# EasyEDA Pro project ProPrj_ESP_AI_MINI_V1.0_2025-04-29.epro

# Schematic Sche_MINI_V1.0

## Sheets
1 Block: Create Date: 2025-03-31; Company: 嘉立创EDA; Page Size: A4; Version: V1.0
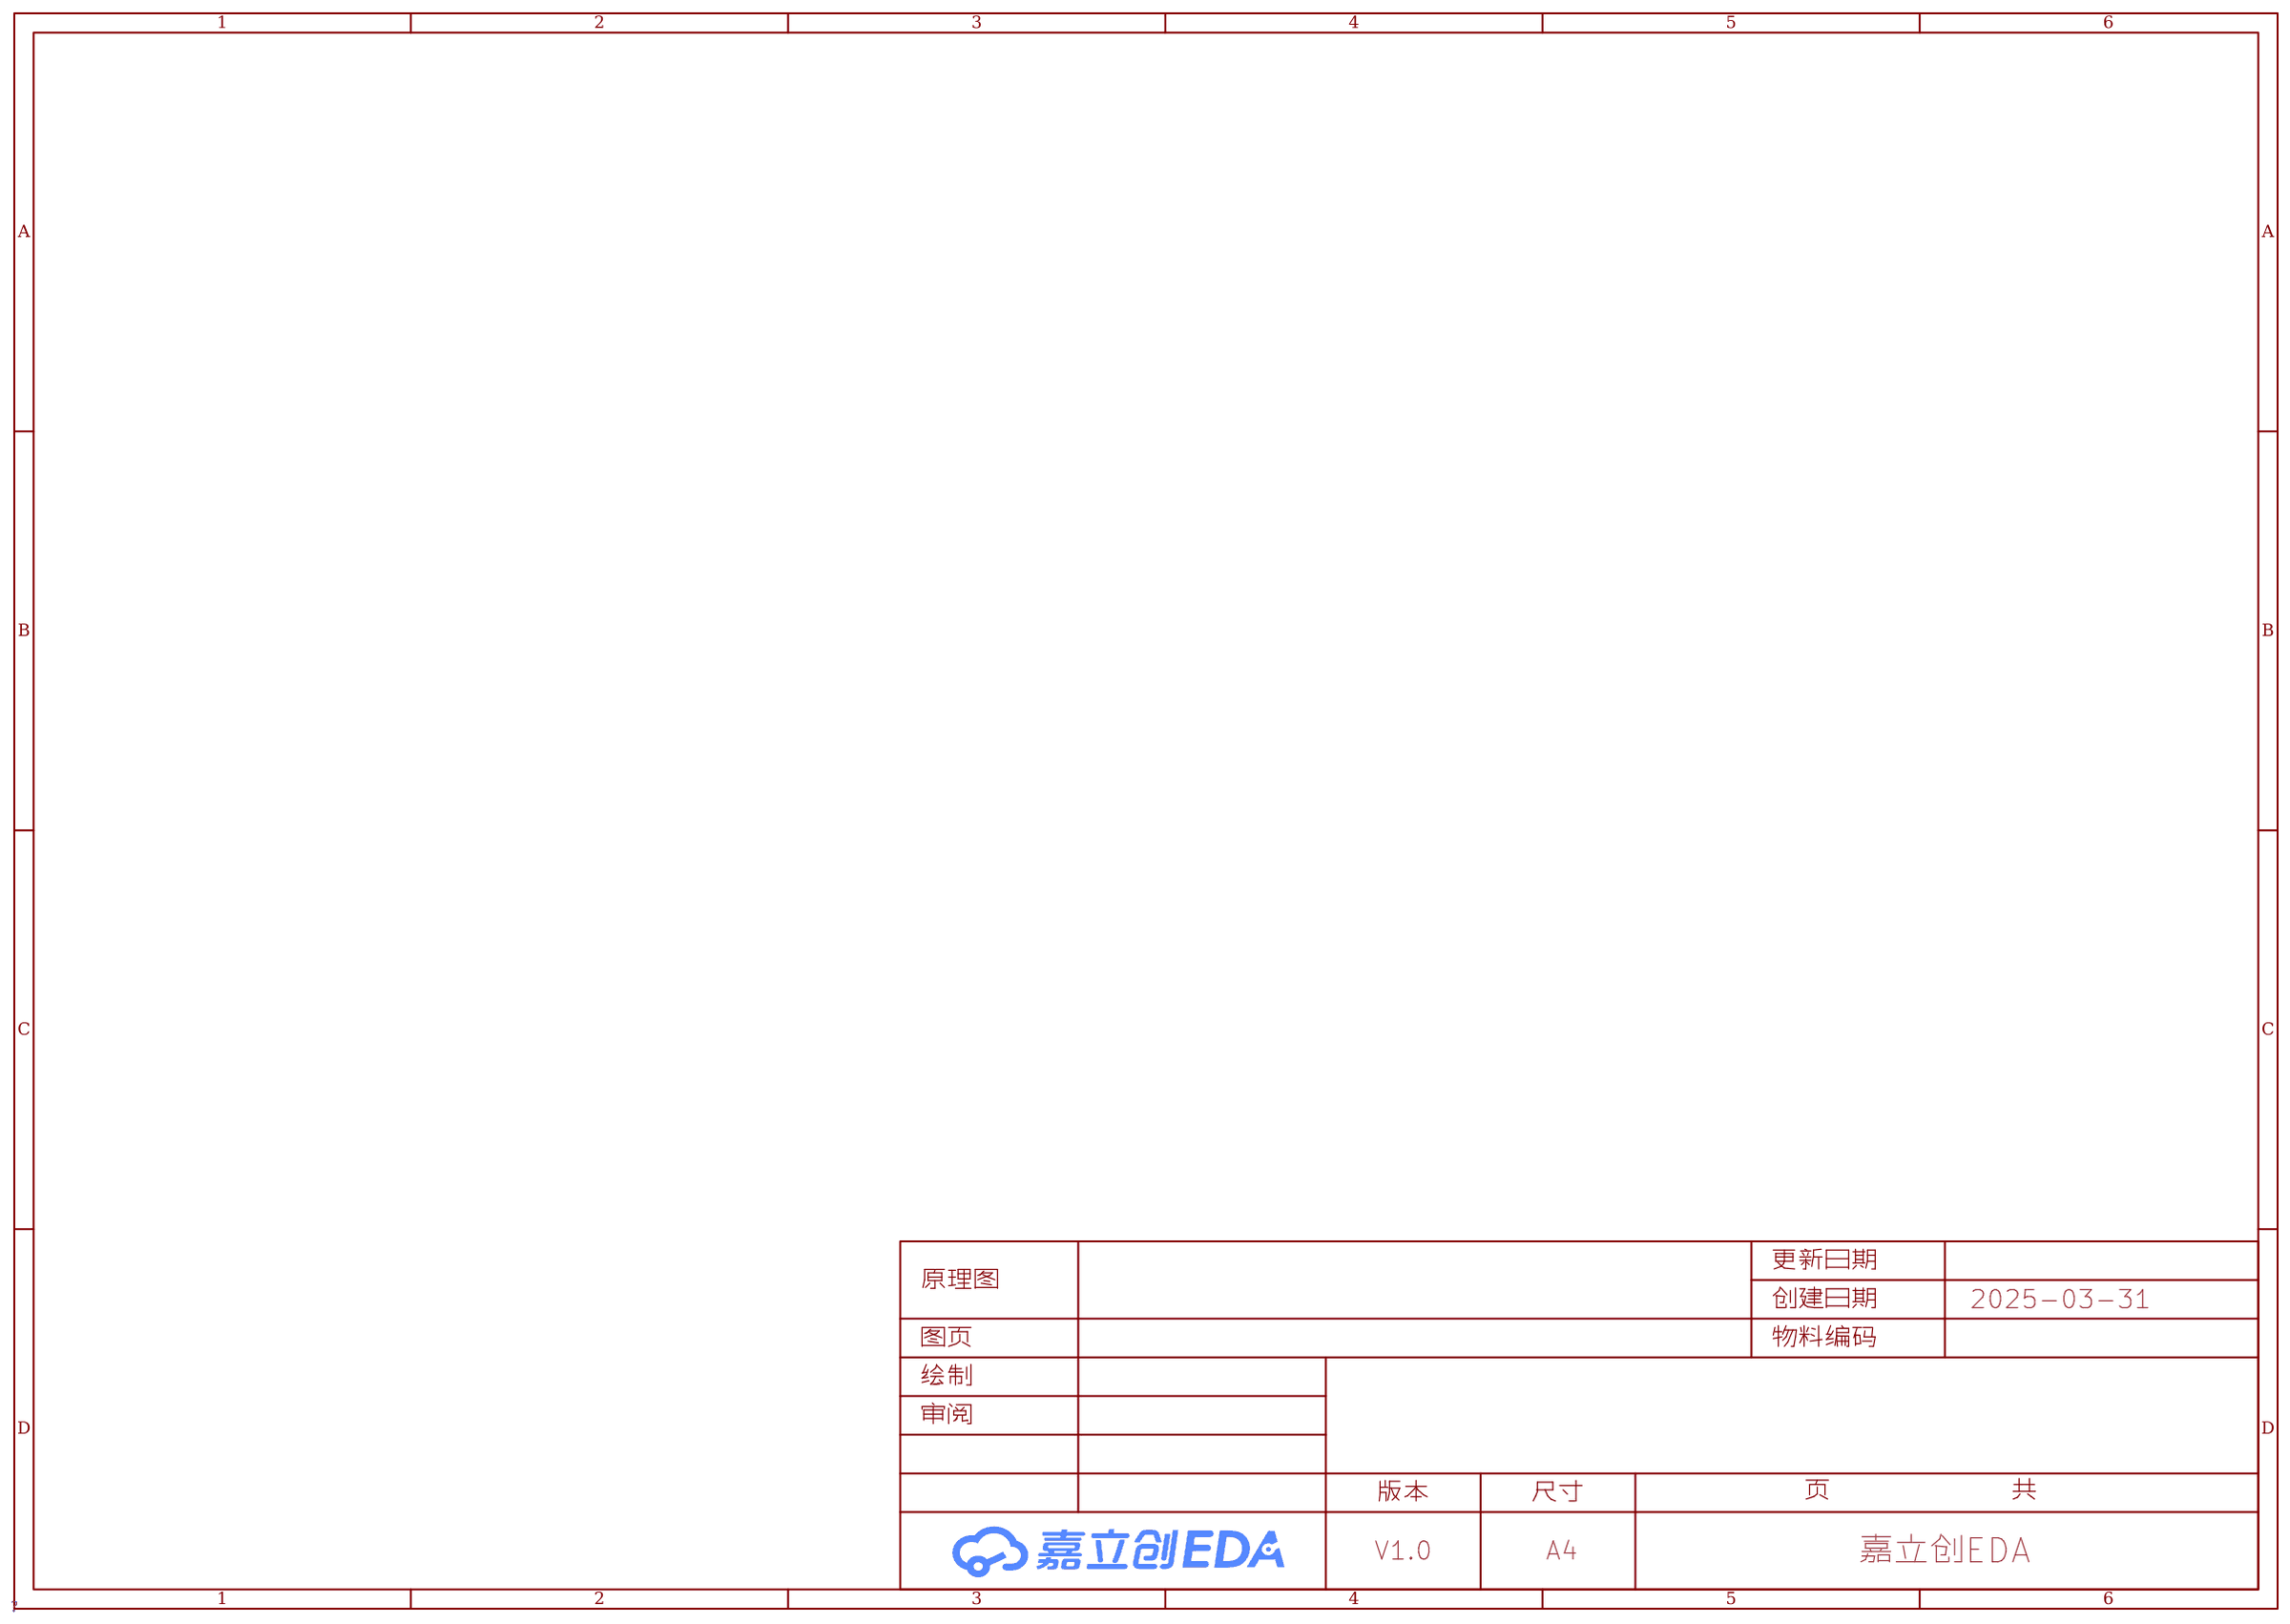
[diagram p0: Block]
2 Power: Board Name: MINI_V1.0; Create Date: 2025-04-07; Page Name: Power; Project Name: ESP_AI_MINI_V1.1; Schematic Name: Sche_MINI_V1.0; Update Date: 2025-04-07
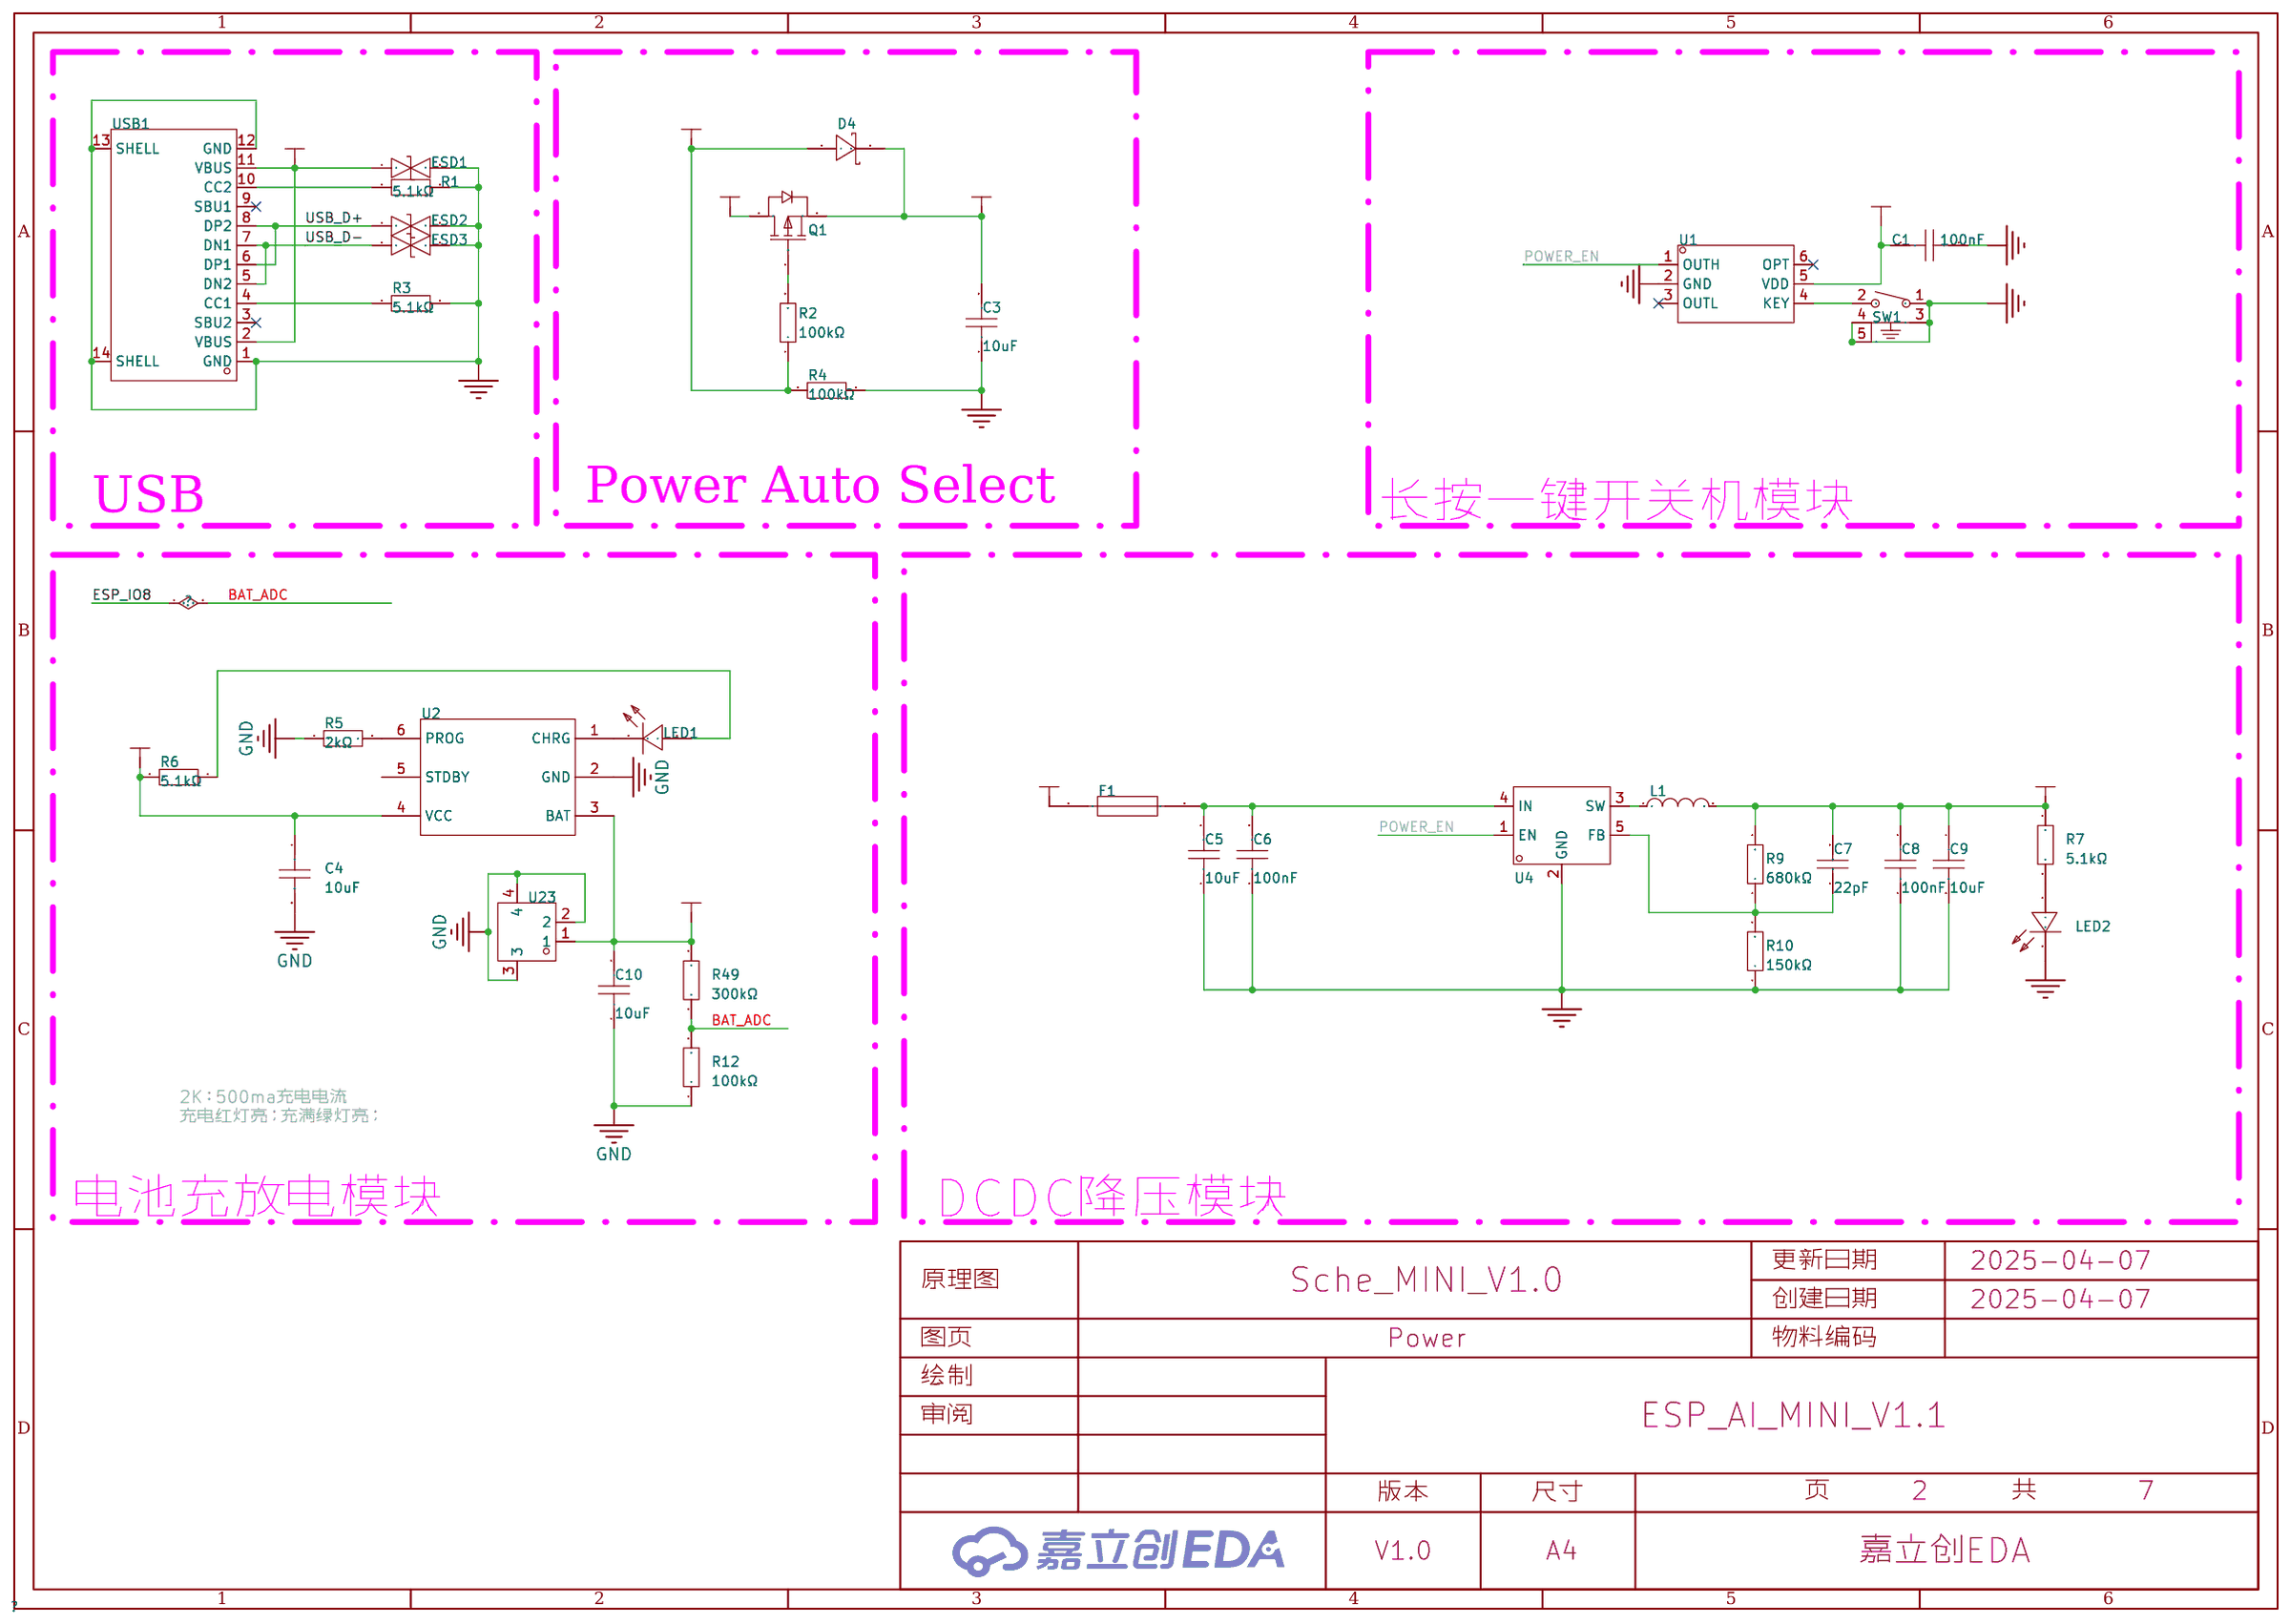
[diagram p1: Power]
3 MCU: Board Name: MINI_V1.0; Page Name: MCU; Project Name: ESP_AI_MINI_V1.0; Schematic Name: Sche_MINI_V1.0; Update Date: 2025-04-04
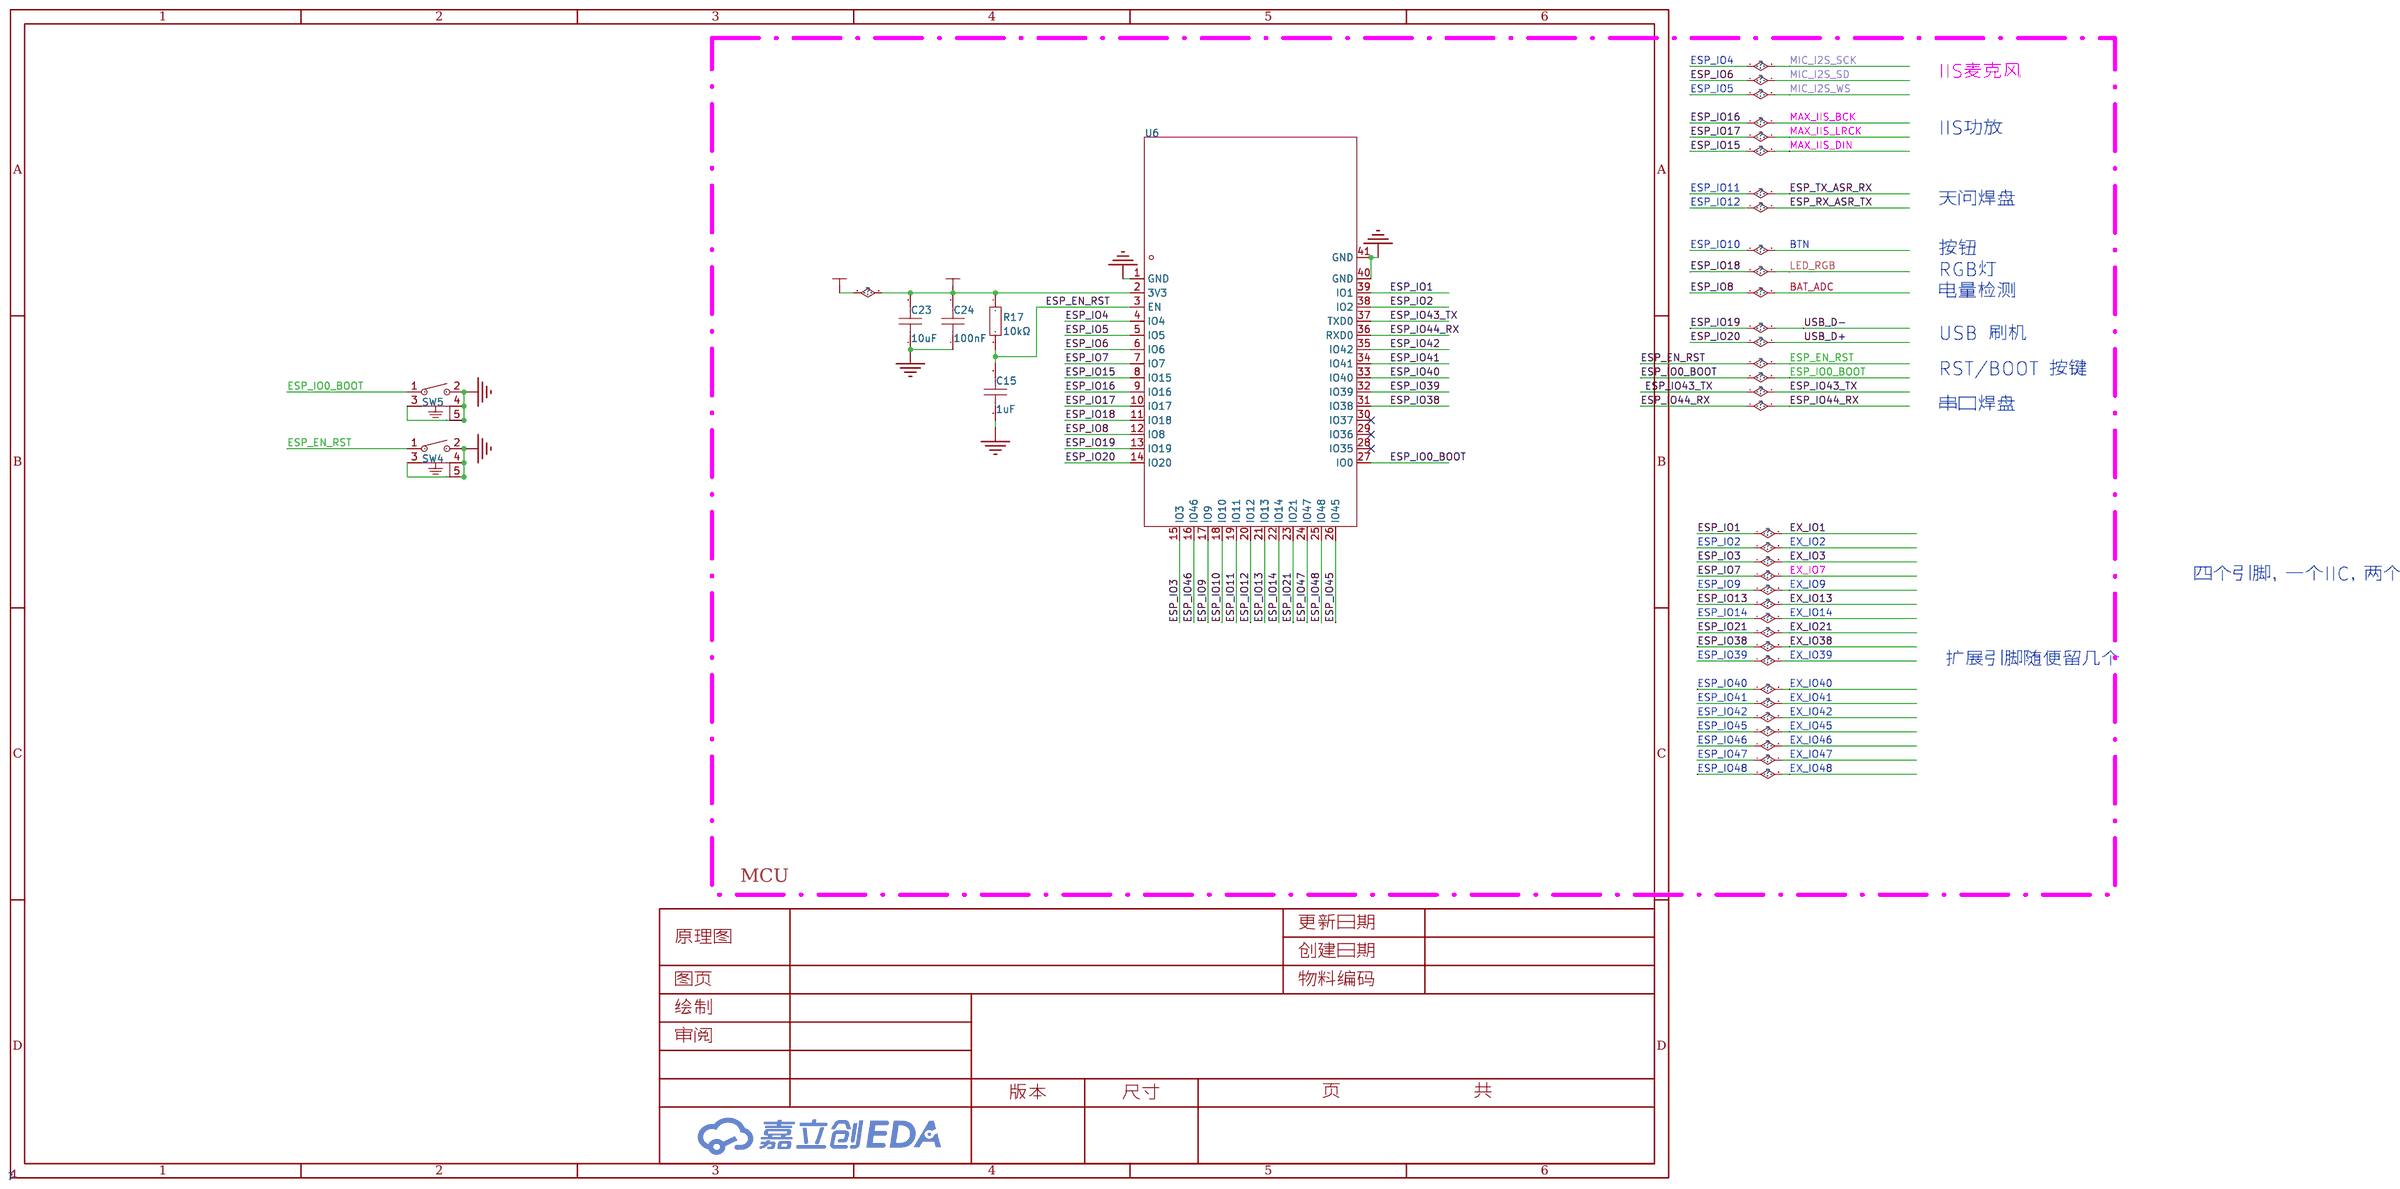
[diagram p2: MCU]
4 Audio: Board Name: MINI_V1.0; Page Name: Audio; Project Name: ESP_AI_MINI_V1.0; Schematic Name: Sche_MINI_V1.0; Update Date: 2025-03-31
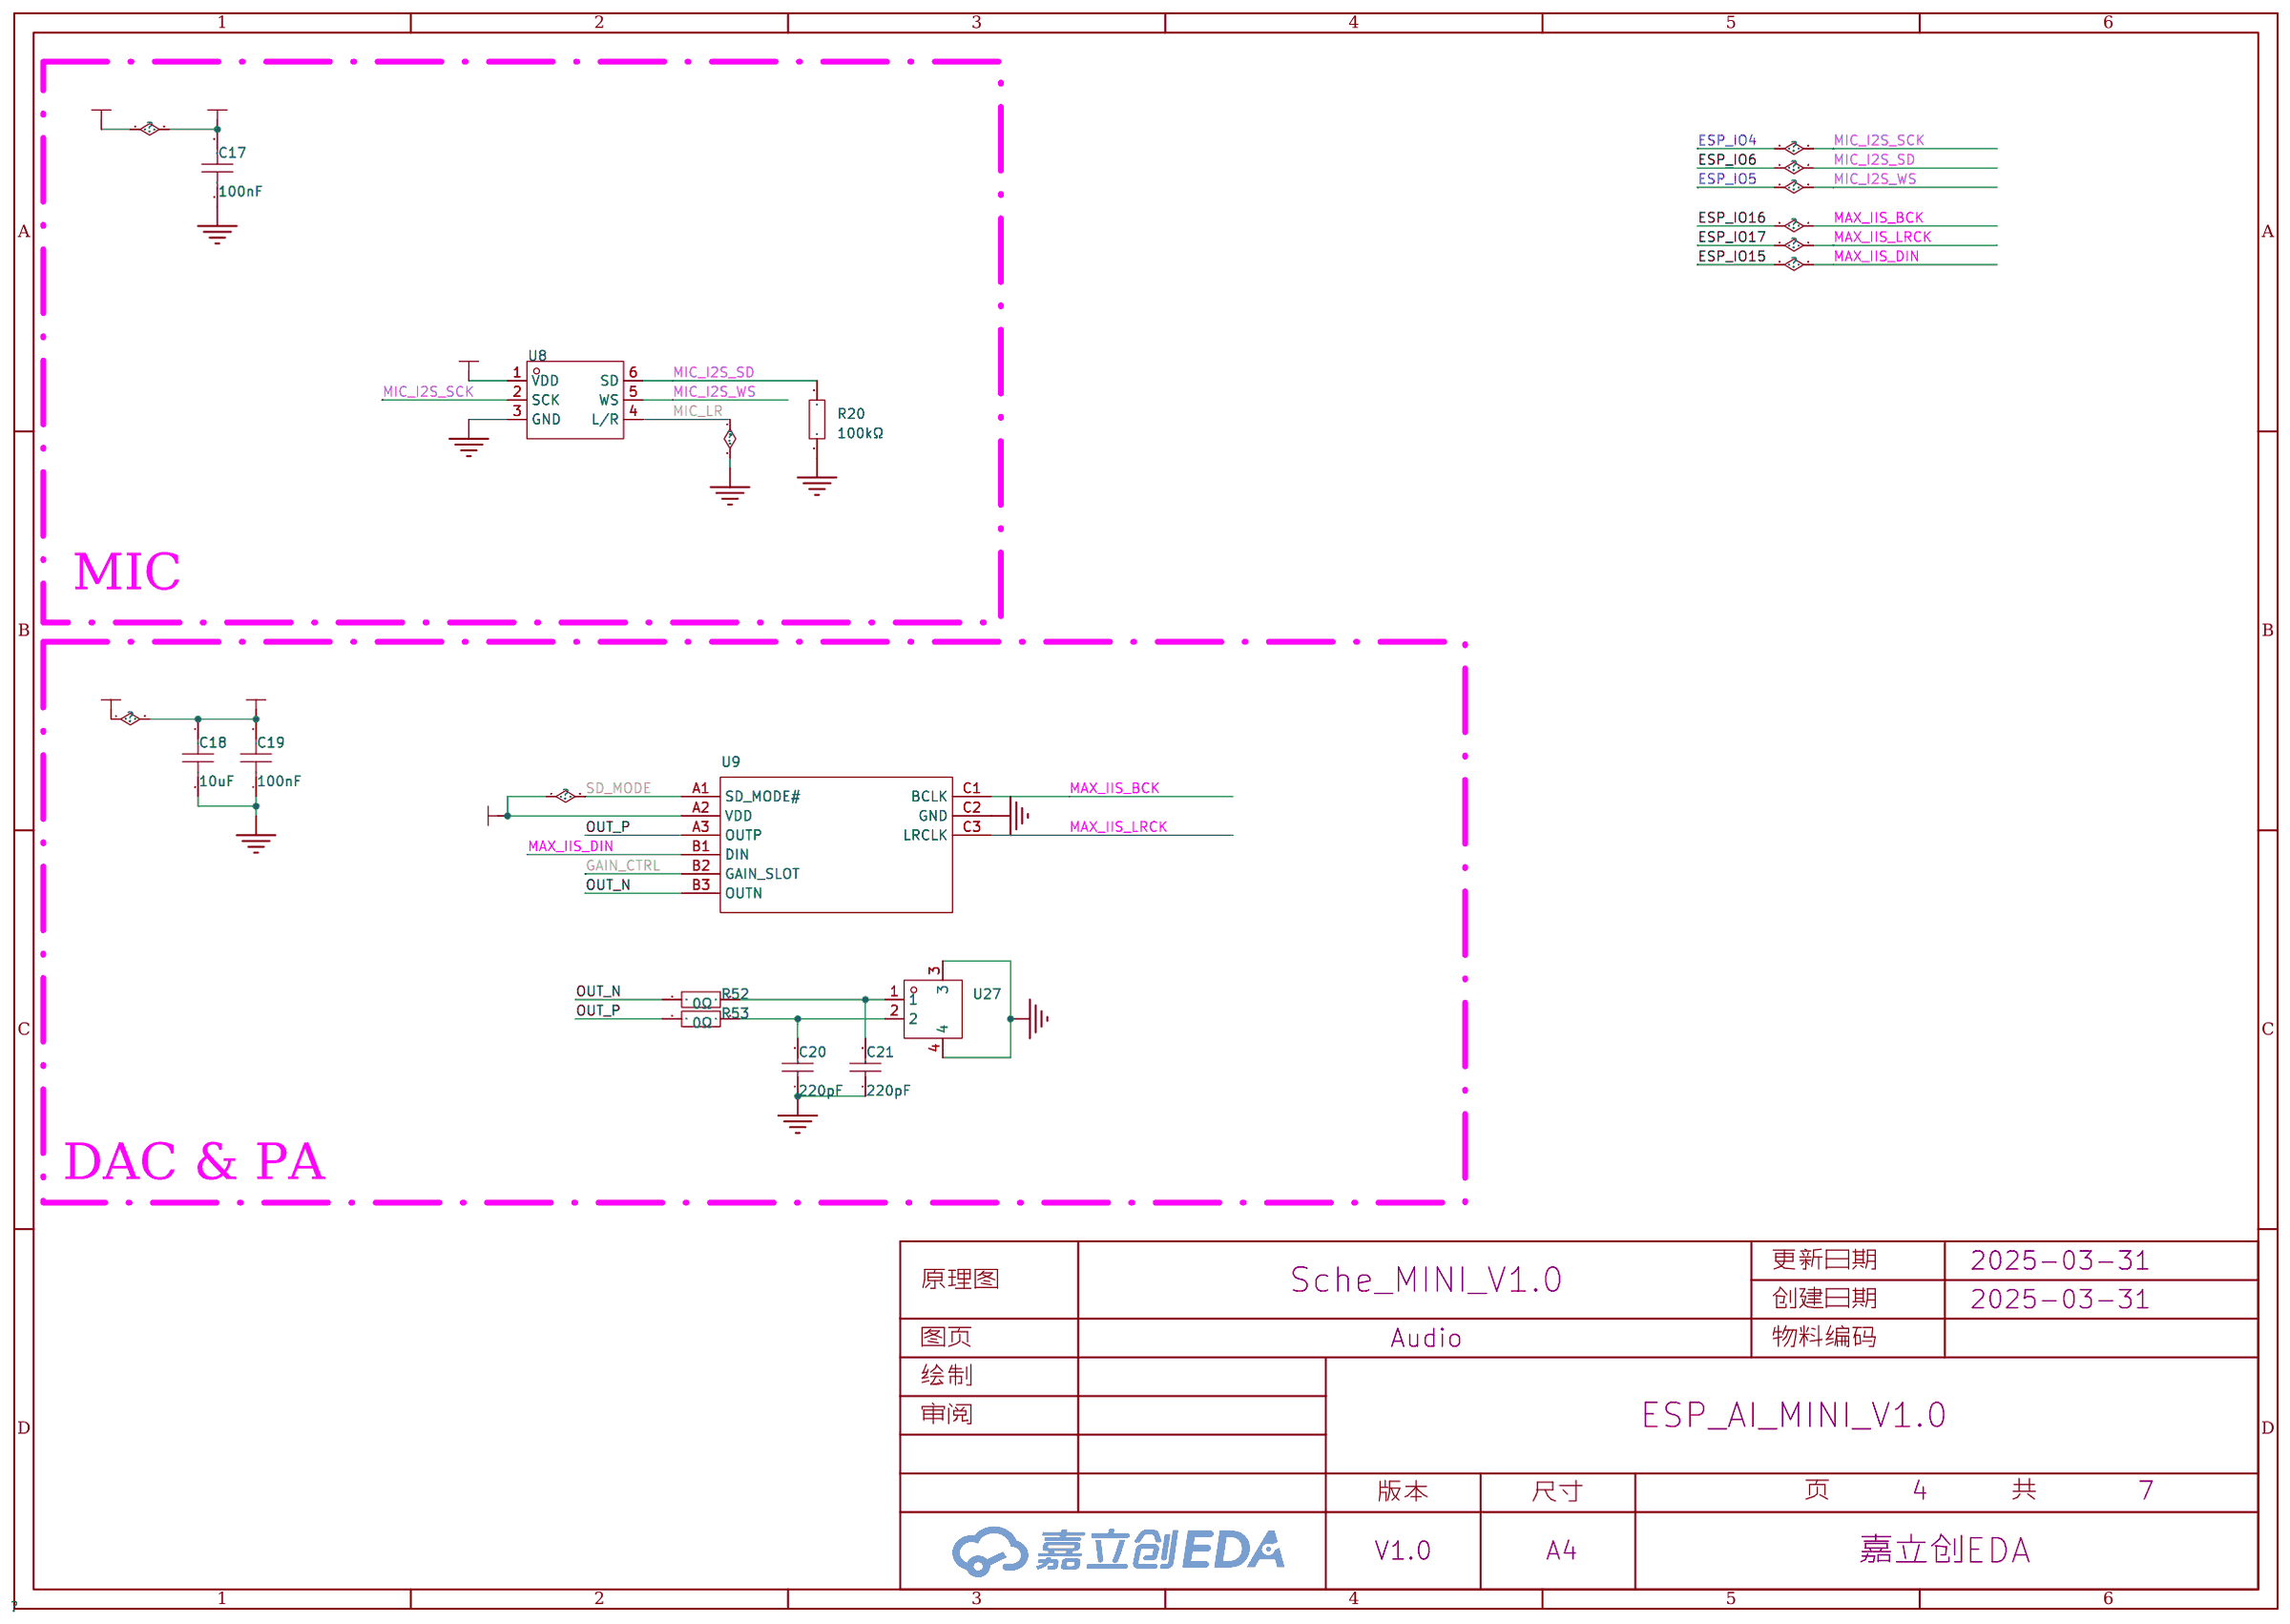
[diagram p3: Audio]
5 Module: Board Name: MINI_V1.0; Page Name: Module; Project Name: ESP_AI_MINI_V1.0; Schematic Name: Sche_MINI_V1.0; Update Date: 2025-04-04
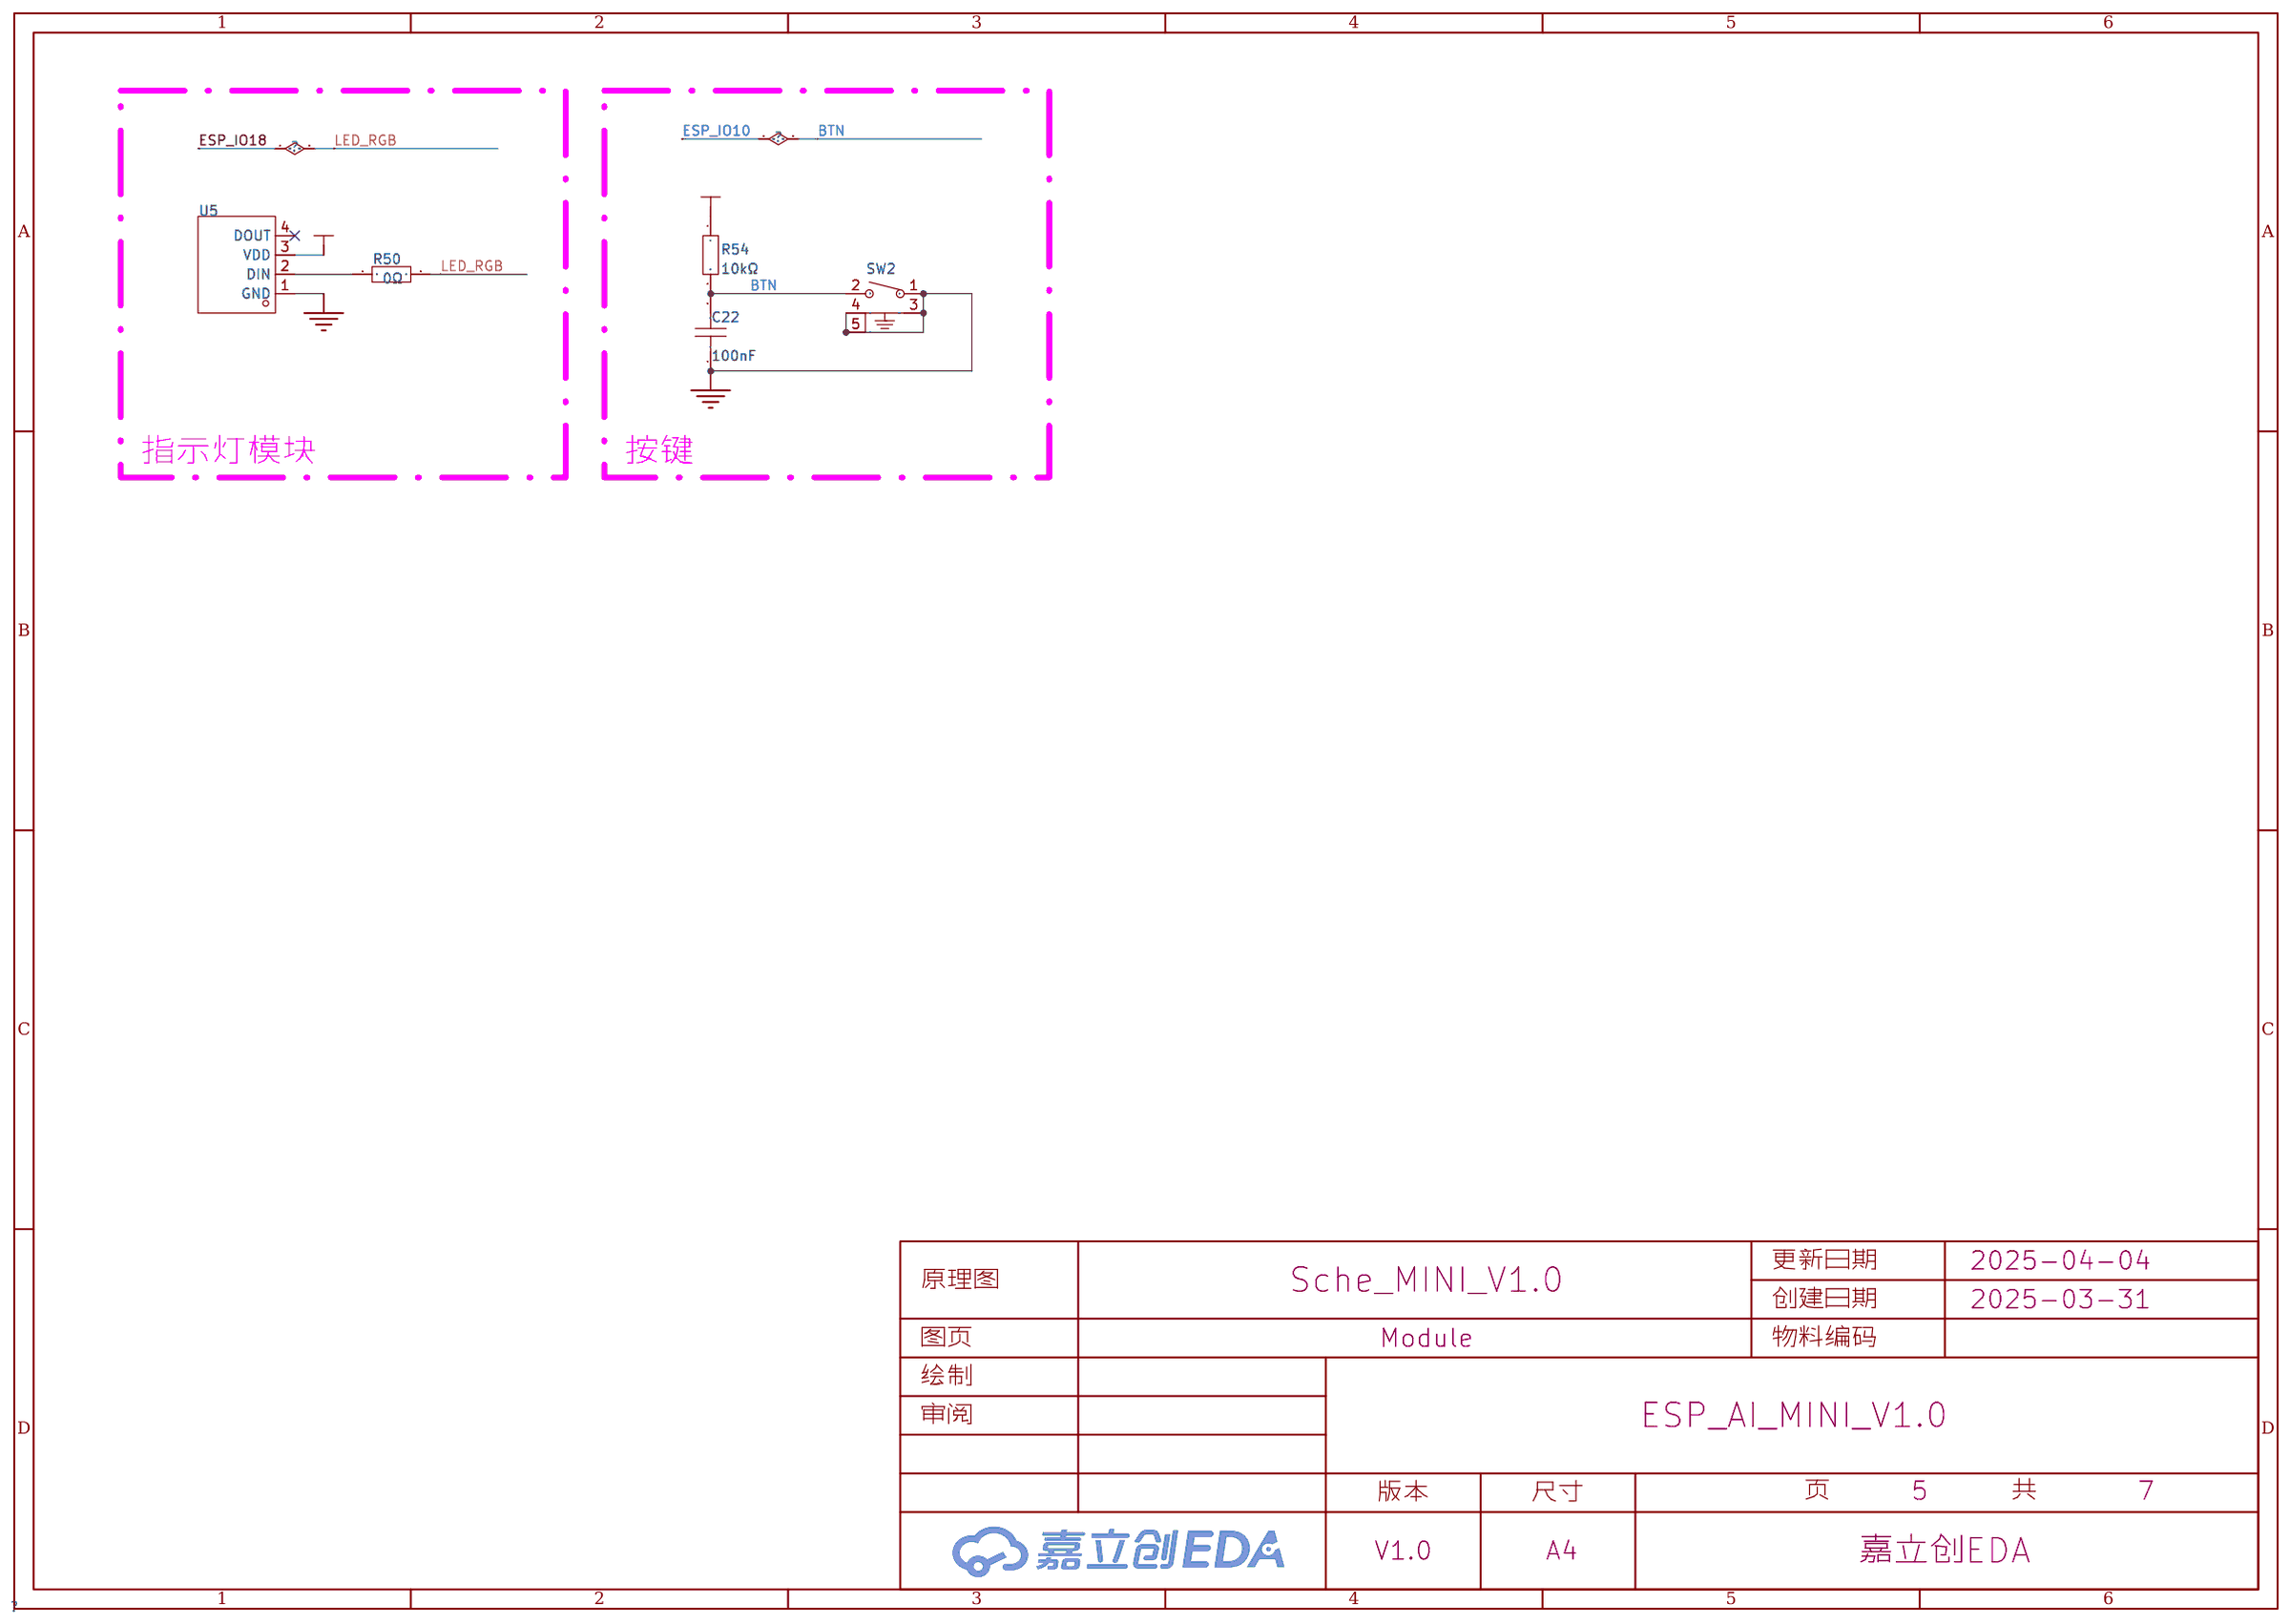
[diagram p4: Module]
6 Interface: Board Name: MINI_V1.0; Create Date: 2025-04-07; Page Name: Interface; Project Name: ESP_AI_MINI_V1.1; Schematic Name: Sche_MINI_V1.0; Update Date: 2025-04-07
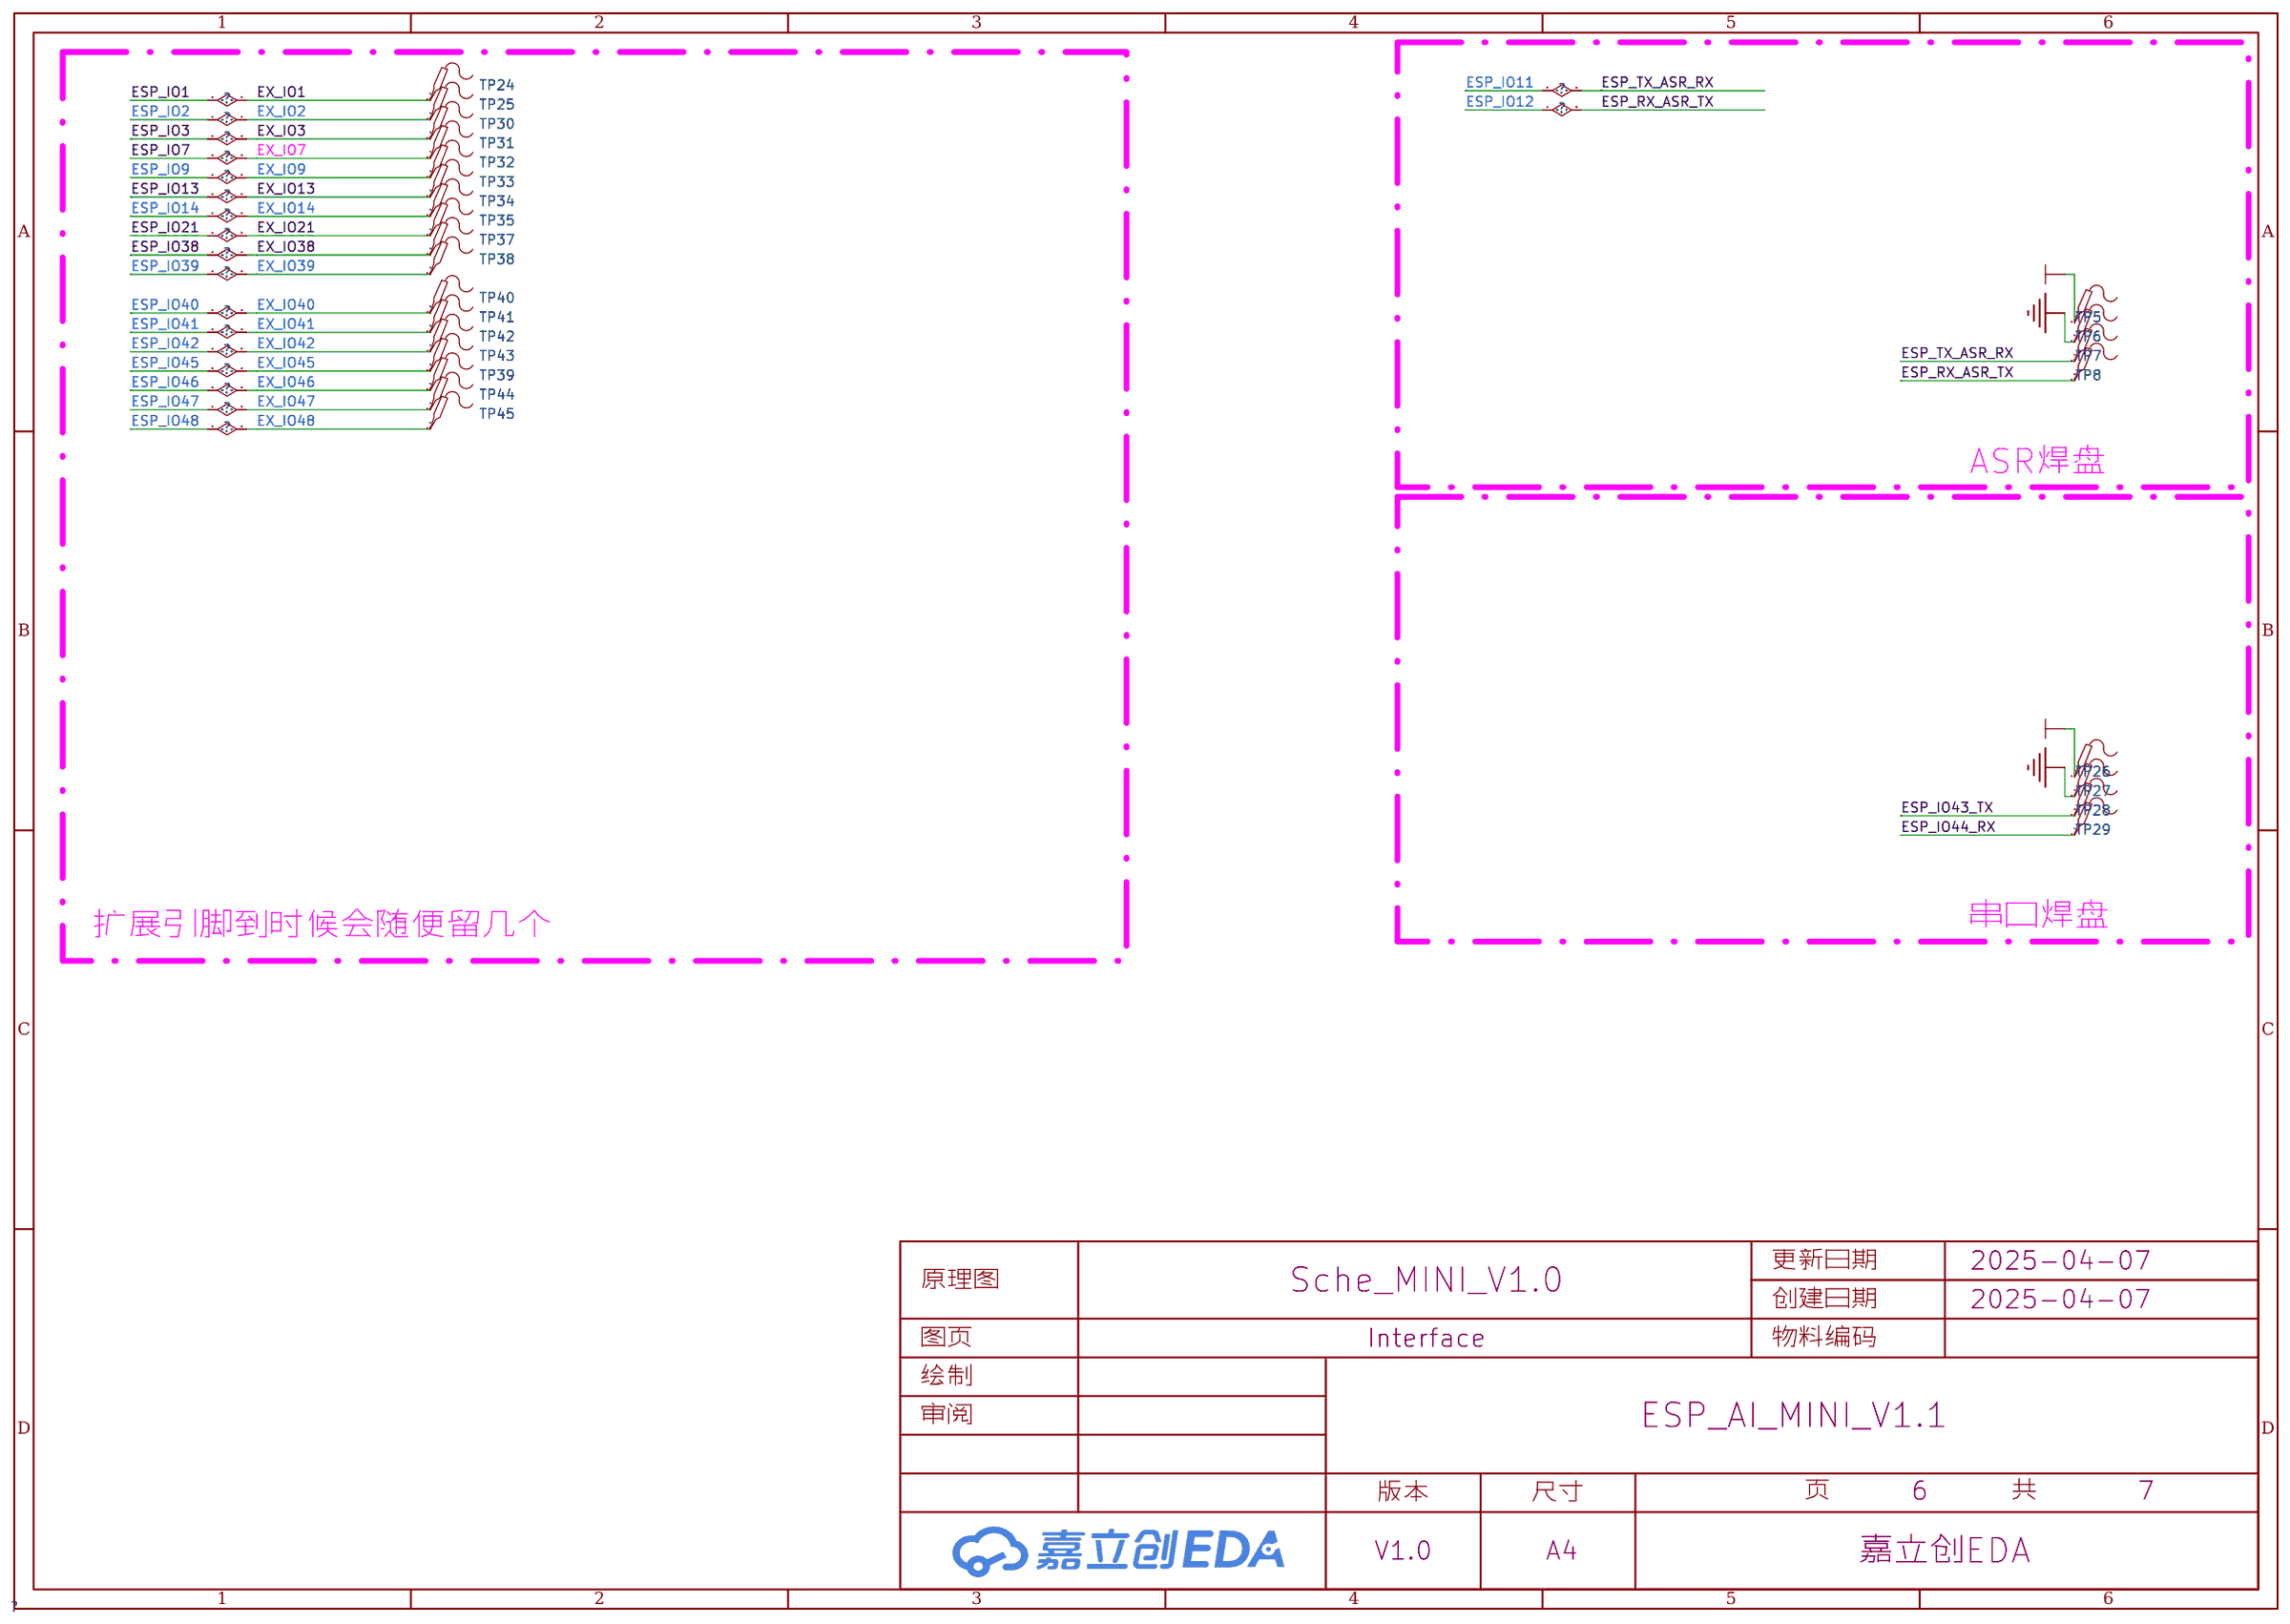
[diagram p5: Interface]
7 Readme: Board Name: MINI_V1.0; Create Date: 2025-04-07; Page Name: Readme; Project Name: ESP_AI_MINI_V1.0; Schematic Name: Sche_MINI_V1.0; Update Date: 2025-04-07
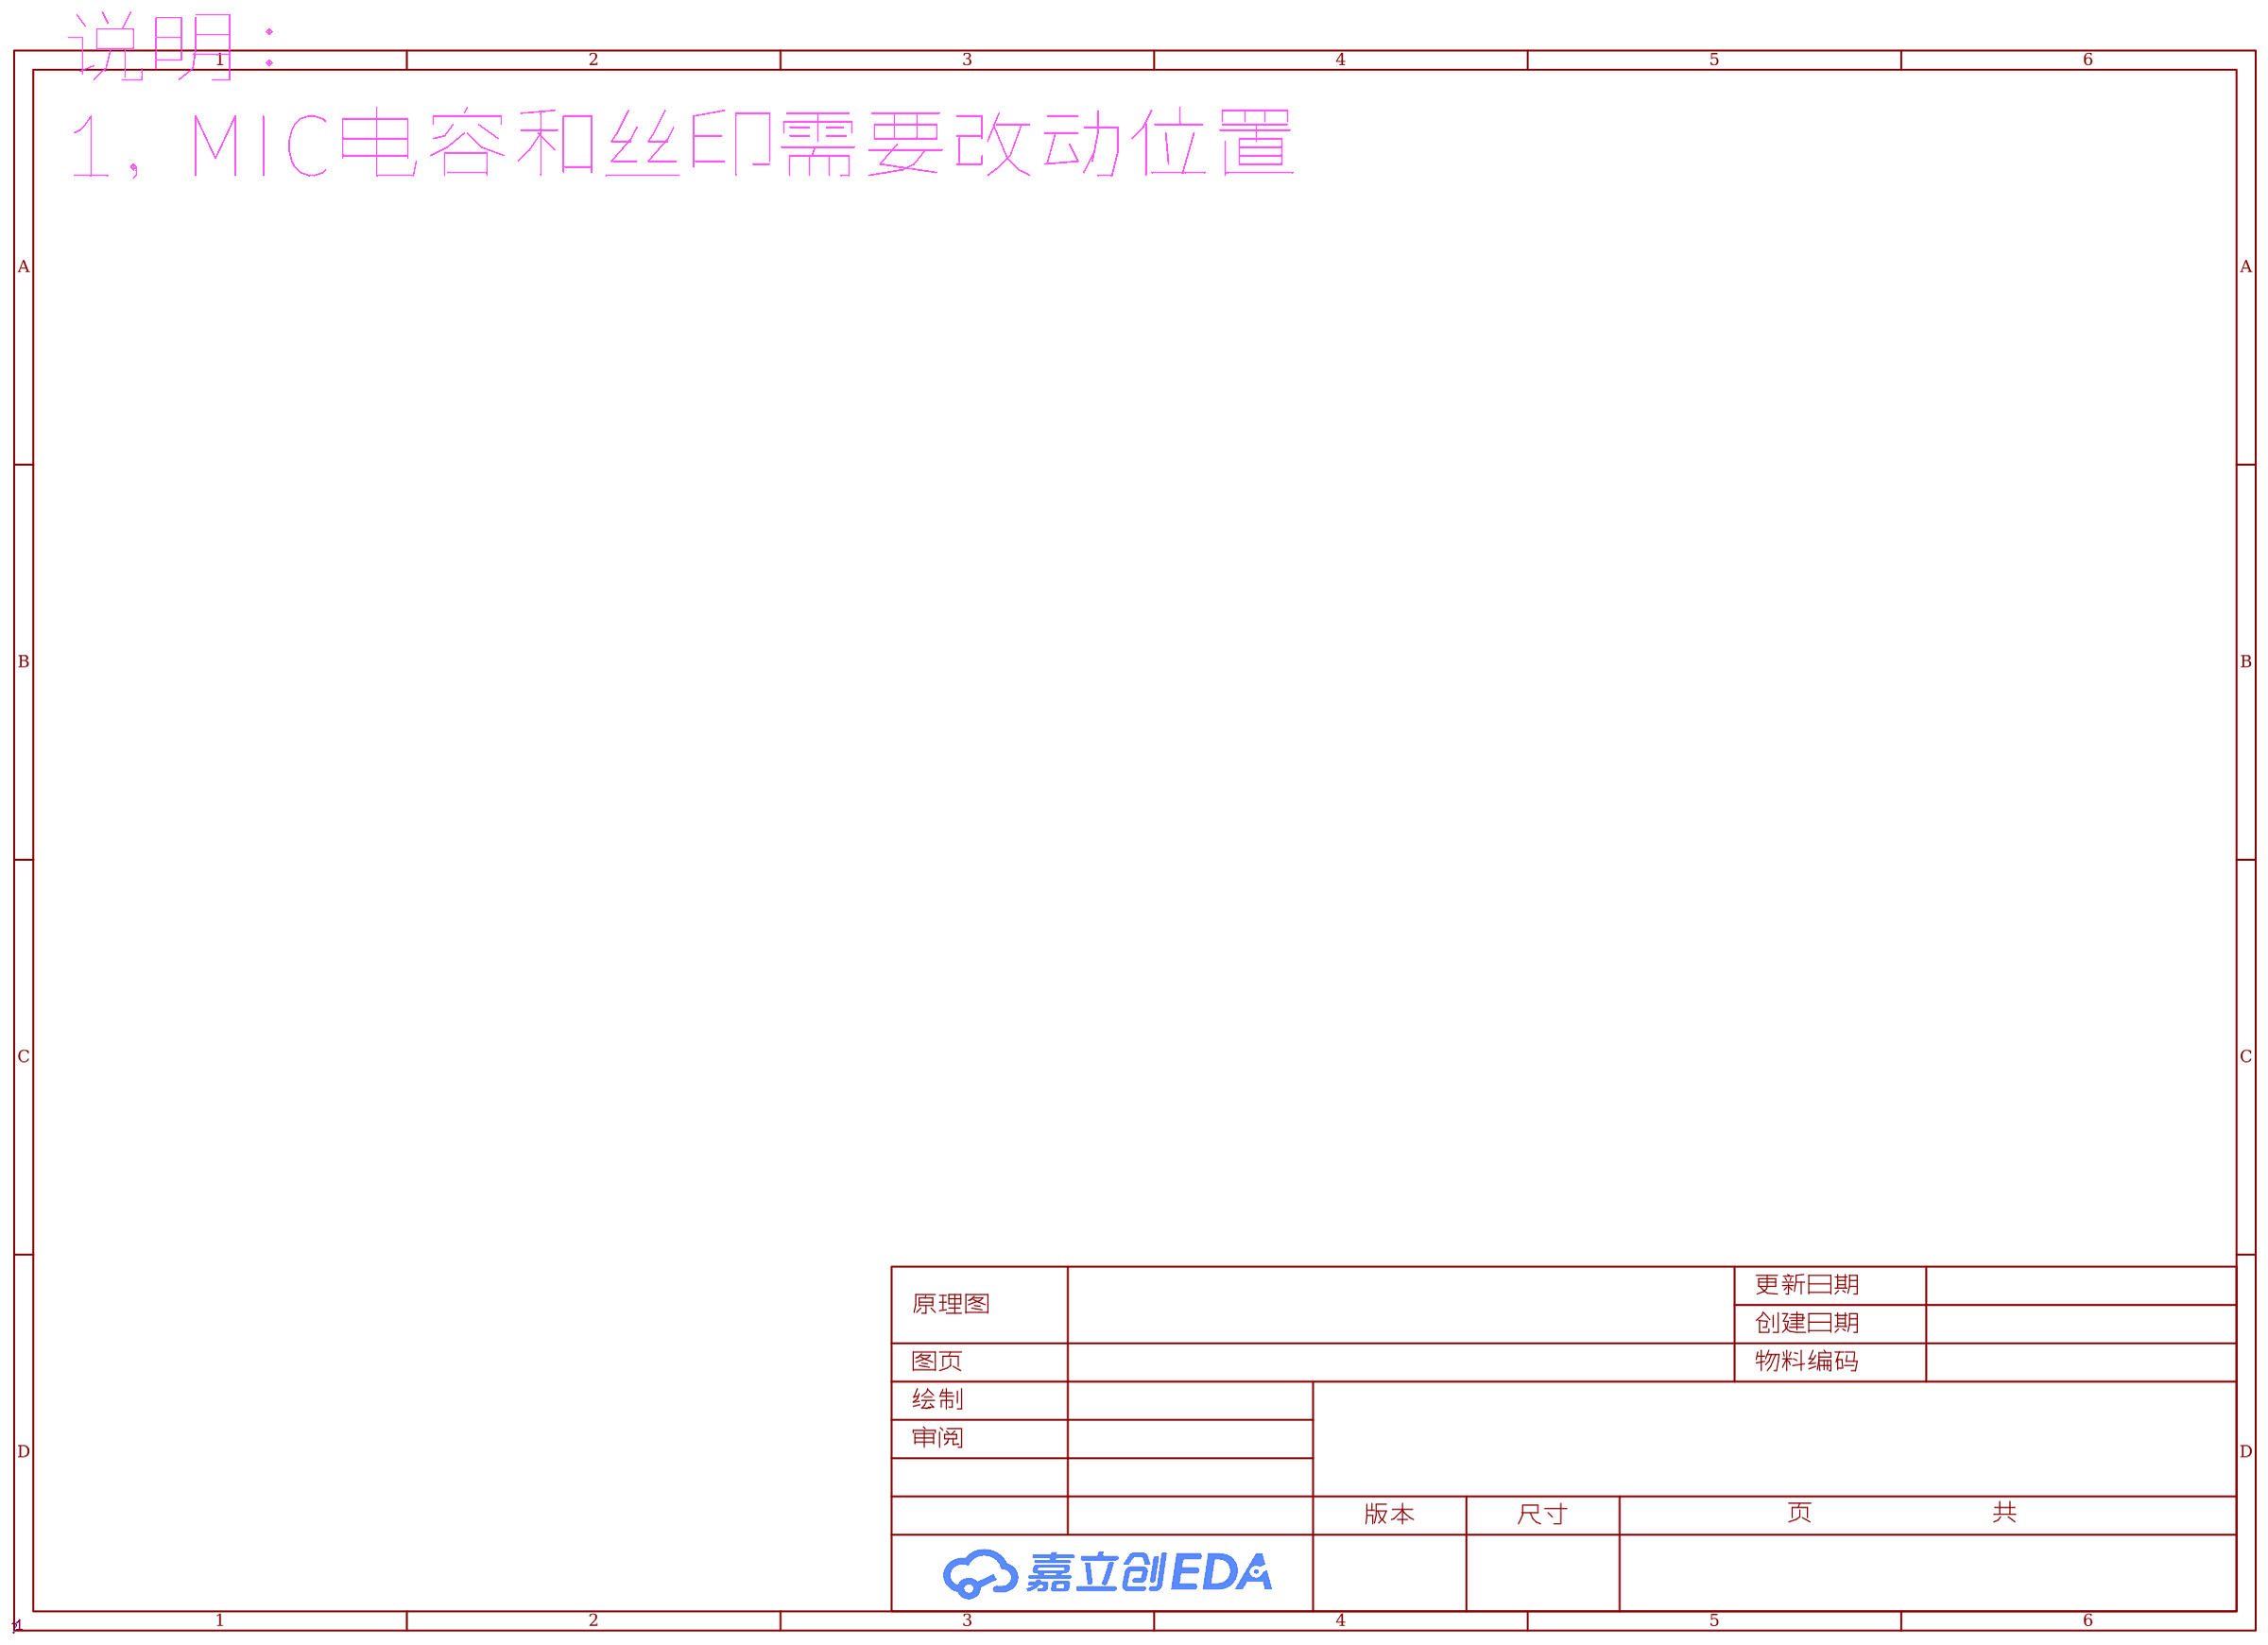
[diagram p6: Readme]

## Parts
sheet Audio
C17  100nF  [C0402]
C18  10uF  [C0603]
C19  100nF  [C0402]
C20  220pF  [C0402]
C21  220pF  [C0402]
R20  100kΩ  [R0402]
R52  0Ω  [R0402]
R53  0Ω  [R0402]
U8  MSM261S3526Z0CM  [MIC-SMD_6P-L3.5-W2.7-P0.90-TR]
U9  MAX98357AEWL+T  [WLP-9_L1.4-W1.3-P0.40-R3-C3-BR]
U27  HCZZ0015-2  [CONN-SMD_HCZZ0015-2]
sheet Interface
TP5  -  [Test-Point-0.5mm]
TP6  -  [Test-Point-0.5mm]
TP7  -  [Test-Point-0.5mm]
TP8  -  [Test-Point-0.5mm]
TP24  -  [Test-Point-0.5mm]
TP25  -  [Test-Point-0.5mm]
TP26  -  [Test-Point-0.5mm]
TP27  -  [Test-Point-0.5mm]
TP28  -  [Test-Point-0.5mm]
TP29  -  [Test-Point-0.5mm]
TP30  -  [Test-Point-0.5mm]
TP31  -  [Test-Point-0.5mm]
TP32  -  [Test-Point-0.5mm]
TP33  -  [Test-Point-0.5mm]
TP34  -  [Test-Point-0.5mm]
TP35  -  [Test-Point-0.5mm]
TP37  -  [Test-Point-0.5mm]
TP38  -  [Test-Point-0.5mm]
TP39  -  [Test-Point-0.5mm]
TP40  -  [Test-Point-0.5mm]
TP41  -  [Test-Point-0.5mm]
TP42  -  [Test-Point-0.5mm]
TP43  -  [Test-Point-0.5mm]
TP44  -  [Test-Point-0.5mm]
TP45  -  [Test-Point-0.5mm]
sheet MCU
C15  1uF  [C0402]
C23  10uF  [C0603]
C24  100nF  [C0402]
R17  10kΩ  [R0402]
SW4  TS-1073A-A2B3-D4  [SW-SMD_TS-1073A-A2B3-D4]
SW5  TS-1073A-A2B3-D4  [SW-SMD_TS-1073A-A2B3-D4]
U6  ESP32-S3-WROOM-1-N16R8  [WIRELM-SMD_ESP32-S3-WROOM-1]
sheet Module
C22  100nF  [C0402]
R50  0Ω  [R0402]
R54  10kΩ  [R0402]
SW2  TS-1073A-A2B3-D4  [SW-SMD_TS-1073A-A2B3-D4]
U5  SK6812MINI-HS  [LED-SMD_4P-L3.5-W3.5-BR_SK6812MINI-HS]
sheet Power
C1  100nF  [C0402]
C3  10uF  [C0603]
C4  10uF  [C0603]
C5  10uF  [C0603]
C6  100nF  [C0402]
C7  22pF  [C0402]
C8  100nF  [C0402]
C9  10uF  [C0603]
C10  10uF  [C0603]
D4  1N5819WS  [SOD-323_L1.8-W1.3-LS2.5-RD]
ESD1  LESD5D5.0CT1G  [SOD-523_L1.2-W0.8-LS1.6-BI]
ESD2  LESD5D5.0CT1G  [SOD-523_L1.2-W0.8-LS1.6-BI]
ESD3  LESD5D5.0CT1G  [SOD-523_L1.2-W0.8-LS1.6-BI]
F1  JK-SMD0603-100L  [F0603]
L1  2.2uH  [IND-SMD_L4.0-W4.0]
LED1  KT-0603R  [LED0603-RD]
LED2  KT-0603R  [LED0603-RD]
Q1  AO3401A  [SOT-23_L2.9-W1.3-P1.90-LS2.4-BR]
R1  5.1kΩ  [R0402]
R2  100kΩ  [R0402]
R3  5.1kΩ  [R0402]
R4  100kΩ  [R0402]
R5  2kΩ  [R0402]
R6  5.1kΩ  [R0402]
R7  5.1kΩ  [R0402]
R9  680kΩ  [R0402]
R10  150kΩ  [R0402]
R12  100kΩ  [R0402]
R49  300kΩ  [R0402]
SW1  TS-1073A-A2B3-D4  [SW-SMD_TS-1073A-A2B3-D4]
U1  ECJ22091-90DE54  [SOT-23-6_L2.9-W1.6-P0.95-LS2.8-BL_1]
U2  TP4057  [SOT-23-6_L2.9-W1.6-P0.95-LS2.8-BR]
U4  ETA3409S2F  [SOT-23-5_L2.9-W1.6-P0.95-LS2.8-BL_2]
U23  HCZZ0015-2  [CONN-SMD_HCZZ0015-2]
USB1  TYPE-C 16PIN 2MD(073)  [USB-C-SMD_TYPE-C-6PIN-2MD-073]

## Library data of the parts
C1 C6 C8 C17 C19 C22 C24 = CL05B104KO5NNNC: 容值:100nF;精度:±10%;额定电压:16V;材质(温度系数):X7R;; LCSC Part Name: 100nF ±10% 16V; Supplier Part: C1525; Manufacturer: SAMSUNG(三星); Supplier Footprint: 0402; JLCPCB Part Class: 基础库; Datasheet: https://atta.szlcsc.com/upload/public/pdf/source/20160218/1457707763339.pdf; Supplier: LCSC; Tolerance: ±10%; Voltage Rated: 16V; Temperature Coefficient: X7R
C18 = CL10A106KP8NNNC: 容值:10uF;精度:±10%;额定电压:10V;材质(温度系数):X5R;; LCSC Part Name: 10uF ±10% 10V; Supplier Part: C19702; Manufacturer: SAMSUNG(三星); Supplier Footprint: 0603; JLCPCB Part Class: Basic Part; Datasheet: https://atta.szlcsc.com/upload/public/pdf/source/20160103/1457707703378.pdf; Supplier: LCSC; Tolerance: ±10%; Voltage Rated: 10V; Temperature Coefficient: X5R; Check: true
C20 C21 = 0402B221K500NT: 容值:220pF;精度:±10%;额定电压:50V;材质(温度系数):X7R;; LCSC Part Name: 220pF ±10% 50V; Supplier Part: C1530; Manufacturer: FH(风华); Supplier Footprint: 0402; JLCPCB Part Class: 基础库; Datasheet: https://atta.szlcsc.com/upload/public/pdf/source/20200305/C486355_26A10D38EF8C2A5C37091D0039909270.pdf; Supplier: LCSC; Tolerance: ±10%; Voltage Rated: 50V; Temperature Coefficient: X7R
R2 R4 R12 R20 = 0402WGF1003TCE: 电阻类型:厚膜电阻;阻值:100kΩ;精度:±1%;功率:62.5mW;最大工作电压:50V;温度系数:±100ppm/℃;; LCSC Part Name: 100kΩ ±1% 62.5mW 厚膜电阻; Supplier Part: C25741; Manufacturer: UNI-ROYAL(厚声); Supplier Footprint: 0402; JLCPCB Part Class: 基础库; Datasheet: https://atta.szlcsc.com/upload/public/pdf/source/20200306/C422600_1E6D84923E4A46A82E41ADD87F860B5C.pdf; Supplier: LCSC; Type: 厚膜电阻; Tolerance: ±1%; Power(Watts): 62.5mW; Overload Voltage (Max): 50V; Temperature Coefficient: ±100ppm/℃; Operating Temperature Range: -55℃~+155℃
R50 R52 R53 = 0402WGF0000TCE: 电阻类型:厚膜电阻;阻值:0Ω;精度:±1%;功率:62.5mW;最大工作电压:50V;温度系数:±800ppm/℃;; LCSC Part Name: 0Ω ±1% 62.5mW 厚膜电阻; Supplier Part: C17168; Manufacturer: UNI-ROYAL(厚声); Supplier Footprint: 0402; JLCPCB Part Class: 基础库; Datasheet: https://atta.szlcsc.com/upload/public/pdf/source/20200306/C422600_1E6D84923E4A46A82E41ADD87F860B5C.pdf; Supplier: LCSC; Type: 厚膜电阻; Tolerance: ±1%; Power(Watts): 62.5mW; Overload Voltage (Max): 50V; Temperature Coefficient: ±800ppm/℃; Operating Temperature Range: -55℃~+155℃
U8 = MSM261S3526Z0CM: 方向:全指向;灵敏度:-26dB;信噪比:64dB;电流消耗:750uA;电源电压:1.8V;阻抗:-;; Supplier Part: C966933; Manufacturer: MEMS(敏芯微); Supplier Footprint: SMD,3.5x2.65x0.98mm; JLCPCB Part Class: 扩展库; Datasheet: https://atta.szlcsc.com/upload/public/pdf/source/20210104/C966933_3269232C81BB891E12095FC7E88FC637.pdf; Supplier: LCSC; Direction: 全指向; Sensitivity: -26dB; SNR(Signal to Noise Ratio): 64dB; Current Consumption: 750uA; Supply Voltage: 1.8V
U9 = MAX98357AEWL+T: 功放类型:-;扬声器通道数:单声道;输出功率:3.2Wx2@4Ω;; Supplier Part: C2682619; Manufacturer: ADI(亚德诺)/MAXIM(美信); Supplier Footprint: BGA-9(1.3x1.3); JLCPCB Part Class: 扩展库; Datasheet: https://atta.szlcsc.com/upload/public/pdf/source/20210106/C2682619_15CCD654F2C559A2FC5FDCA8EA0D4E6D.pdf; Supplier: LCSC; Speaker Channels: 单声道; Output Power: 3.2Wx2@4Ω; Supply Voltage: 2.5V~5.5V; Operating Temperature: -40℃~+85℃
U23 U27 = HCZZ0015-2: 插针结构:1x2P;间距:1.25mm;安装方式:立贴;参考系列:PicoBlade(MX 1.25);总PIN数:2P;排数:1;每排PIN数:2;行距:-;额定电流:1A;触头材质:铜;触头镀层:锡;工作温度范围:-25℃~+70℃;; LCSC Part Name: 米色 1x2P 间距:1.25mm 立贴 系列:PicoBlade(MX 1.25); Supplier Part: C7433468; Manufacturer: HC(虹成电子); Supplier Footprint: SMD,P=1.25mm; JLCPCB Part Class: 扩展库; Datasheet: https://atta.szlcsc.com/upload/public/pdf/source/20250106/AA5F2339352427E7DADF202EDB165965.pdf; Supplier: LCSC; Pins Structure: 1x2P; Pitch: 1.25mm; Mounting Type: 立贴; Reference Series: PicoBlade(MX 1.25); Number of Pins: 2P; Number of Rows: 1; Number of PINs Per Row: 2; Current Rating: 1A; Contact Material: 铜; Contact Plating: 锡; Operating Temperature: -25℃~+70℃; Voltage Rating: 125V; Plastic Material: LCP; Color: 米色; Z-Height of the Board: 4.6mm; X-Length of Bottom Edge on Board (Spacing Line): 7.6mm; Y-Width of Bottom Edge on Board: 4.3mm
TP5-TP8 TP24-TP35 TP37-TP45 = Test-Point: Test Point 测试点
C15 = CL05A105KA5NQNC: 容值:1uF;精度:±10%;额定电压:25V;材质(温度系数):X5R;; LCSC Part Name: 1uF ±10% 25V; Supplier Part: C52923; Manufacturer: SAMSUNG(三星); Supplier Footprint: 0402; JLCPCB Part Class: 基础库; Datasheet: https://atta.szlcsc.com/upload/public/pdf/source/20160218/1457707763339.pdf; Supplier: LCSC; Tolerance: ±10%; Voltage Rated: 25V; Temperature Coefficient: X5R
C3 C4 C10 C23 = CL10A106KP8NNNC: 容值:10uF;精度:±10%;额定电压:10V;材质(温度系数):X5R;; LCSC Part Name: 10uF ±10% 10V; Supplier Part: C19702; Manufacturer: SAMSUNG(三星); Supplier Footprint: 0603; JLCPCB Part Class: Basic Part; Datasheet: https://atta.szlcsc.com/upload/public/pdf/source/20160103/1457707703378.pdf; Supplier: LCSC; Tolerance: ±10%; Voltage Rated: 10V; Temperature Coefficient: X5R
R17 R54 = 0402WGF1002TCE: 电阻类型:厚膜电阻;阻值:10kΩ;精度:±1%;功率:62.5mW;最大工作电压:50V;温度系数:±100ppm/℃;; LCSC Part Name: 10kΩ ±1% 62.5mW 厚膜电阻; Supplier Part: C25744; Manufacturer: UNI-ROYAL(厚声); Supplier Footprint: 0402; JLCPCB Part Class: 基础库; Datasheet: https://atta.szlcsc.com/upload/public/pdf/source/20200306/C422600_1E6D84923E4A46A82E41ADD87F860B5C.pdf; Supplier: LCSC; Type: 厚膜电阻; Tolerance: ±1%; Power(Watts): 62.5mW; Overload Voltage (Max): 50V; Temperature Coefficient: ±100ppm/℃; Operating Temperature Range: -55℃~+155℃
SW1 SW2 SW4 SW5 = TS-1073A-A2B3-D4: 电路结构:单刀单掷;按钮形状:矩形按钮;作用力:250gf;安装方式:-;带灯:-;机械寿命:-;; LCSC Part Name: 轻触开关4.7*1.9*3.5mm侧按2*4*3.5贴片带支架250gf; Supplier Part: C492941; Manufacturer: Yuandi(元迪); JLCPCB Part Class: 扩展库; Datasheet: https://atta.szlcsc.com/upload/public/pdf/source/20200316/C492940_9943A0CF404D08218361BA1FDE575510.pdf; Supplier: LCSC; Circuit: 单刀单掷; Actuator Style: 矩形按钮; Operating Force: 250gf
U6 = ESP32-S3-WROOM-1-N16R8: LCSC Part Name: 通用型Wi-Fi+低功耗蓝牙MCU模组; Supplier Part: C2913202; Manufacturer: ESPRESSIF(乐鑫); Supplier Footprint: SMD,18x25.5mm; JLCPCB Part Class: 扩展库; Datasheet: https://atta.szlcsc.com/upload/public/pdf/source/20220705/4E799F39581577F766659887F738A439.pdf; Supplier: LCSC
U5 = SK6812MINI-HS: Supplier Part: C2922787; Manufacturer: 欧思科光电; Supplier Footprint: SMD,3.5x3.7mm; JLCPCB Part Class: 扩展库; Datasheet: https://atta.szlcsc.com/upload/public/pdf/source/20230410/362AD3320BBA53091A00A690D4E4D8BC.pdf; Supplier: LCSC
C5 C9 = CL10A106KP8NNNC: 容值:10uF;精度:±10%;额定电压:10V;材质(温度系数):X5R;; LCSC Part Name: 10uF ±10% 10V; Supplier Part: C19702; Manufacturer: SAMSUNG(三星); Supplier Footprint: 0603; JLCPCB Part Class: Basic Part; Datasheet: https://atta.szlcsc.com/upload/public/pdf/source/20160218/1457707763339.pdf; Supplier: LCSC; Tolerance: ±10%; Voltage Rated: 10V; Temperature Coefficient: X5R; Check: true
C7 = 0402CG220J500NT: 容值:22pF;精度:±5%;额定电压:50V;材质(温度系数):C0G;; LCSC Part Name: 22pF ±5% 50V; Supplier Part: C1555; Manufacturer: FH(风华); Supplier Footprint: 0402; JLCPCB Part Class: 基础库; Datasheet: https://atta.szlcsc.com/upload/public/pdf/source/20200305/C486355_26A10D38EF8C2A5C37091D0039909270.pdf; Supplier: LCSC; Tolerance: ±5%; Voltage Rated: 50V; Temperature Coefficient: C0G
D4 = 1N5819WS_C191023: 正向压降(Vf):600mV@1A;直流反向耐压(Vr):40V;整流电流:1A;; LCSC Part Name: 电压:40V 电流:1A; Supplier Part: C191023; Manufacturer: Hottech(合科泰); Supplier Footprint: SOD-323; JLCPCB Part Class: 基础库; Datasheet: https://atta.szlcsc.com/upload/public/pdf/source/20220428/3CB86FD8D28D653594B4E35F9D5AEFD9.pdf; Supplier: LCSC; Forward Voltage (Vf@If): 600mV@1A; Reverse Voltage (Vr): 40V; Rectified Current: 1A
ESD1-ESD3 = LESD5D5.0CT1G: 极性:双向;反向截止电压(Vrwm):5V;最大钳位电压:18.6V;峰值脉冲电流(Ipp):9.4A;击穿电压:5.6V;; LCSC Part Name: 双向ESD; Supplier Part: C383211; Manufacturer: LRC(乐山无线电); Supplier Footprint: SOD-523; JLCPCB Part Class: 扩展库; Datasheet: https://atta.szlcsc.com/upload/public/pdf/source/20190807/C383211_633DF4B4E2C161403226E5235FE33A1C.pdf; Supplier: LCSC; polarity: 双向; Reverse Stand-Off Voltage (Vrwm): 5V; Maximum Clamping Voltage: 18.6V; Peak Pulse Current (Ipp): 9.4A; Breakdown Voltage: 5.6V; Type: ESD; Polarity: 双向; Breakdown Voltage (VBR): 5.6V; Peak Pulse Current(Ipp)@8/20us: 9.4A; Clamping Voltage@Ipp: 18.6V
F1 = JK-SMD0603-100L: 耐压:6V;最大电流:50A;保持电流(Ih):1A;跳闸电流:2A;; LCSC Part Name: 6V 1A 0603自恢复; Supplier Part: C516069; Manufacturer: JK(金科); Supplier Footprint: 0603; JLCPCB Part Class: 扩展库; Datasheet: https://atta.szlcsc.com/upload/public/pdf/source/20200708/C516069_8ECE3CE483DABC16F21EEE01B7E83616.pdf; Supplier: LCSC; Voltage - Max: 6V; Current - Max: 50A; Hold Current: 1A; Trip Current: 2A; Power Dissipation: 500mW; Resistance - Initial (Ri) (Min): 45mΩ; Resistance - Post Trip (R1) (Max): 120mΩ; Time to Trip(Max): 2s; Operating Temperature: -40℃~+85℃
L1 = SPH4018H2R2MT: 电感值:2.2uH;精度:±20%;额定电流:2.2A;饱和电流(Isat):3A;类型:-;; LCSC Part Name: 2.2uH ±20% 3A; Supplier Part: C370436; Manufacturer: Sunlord(顺络); Supplier Footprint: SMD,4x4x1.8mm; JLCPCB Part Class: Extended Part; Datasheet: https://atta.szlcsc.com/upload/public/pdf/source/20231024/91C3B1E68892D3DB9D2F9A4F7057A096.pdf; Supplier: LCSC; Tolerance: ±20%; Rated Current: 2.2A; Saturation Current (Isat): 3A; DC Resistance (DCR): 42mΩ; Check: true
LED1 LED2 = KT-0603R: 发光颜色:红色;功率:-;正向电流:-;主波长:-;二极管配置:-;透镜颜色:-;色温:-;发光角度:-;载带方式:-;工作温度:-40℃~+85℃;; LCSC Part Name: 0603 红灯 高亮; Supplier Part: C2286; Manufacturer: KENTO; Supplier Footprint: 0603; JLCPCB Part Class: 基础库; Datasheet: https://atta.szlcsc.com/upload/public/pdf/source/20160616/1466072038404.pdf; Supplier: LCSC; Emitted Color: 红色; Operating Temperature: -40℃~+85℃
Q1 = AO3401A_C15127: 类型:1个P沟道;漏源电压(Vdss):30V;连续漏极电流(Id):4A;功率(Pd):1.4W;导通电阻(RDS(on)@Vgs,Id):44mΩ@10V,4.3A;阈值电压(Vgs(th)@Id):1.3V@250uA;; LCSC Part Name: 1个P沟道 耐压:30V 电流:4A; Supplier Part: C15127; Manufacturer: AOS; Supplier Footprint: SOT-23; JLCPCB Part Class: 基础库; Datasheet: https://atta.szlcsc.com/upload/public/pdf/source/20160507/1462613609053.pdf; Supplier: LCSC; Type: 1个P沟道; Drain Source Voltage (Vdss): 30V; Continuous Drain Current (Id): 4A; Power Dissipation (Pd): 1.4W; Drain Source On Resistance (RDS(on)@Vgs,Id): 44mΩ@10V,4.3A; Gate Threshold Voltage (Vgs(th)@Id): 1.3V@250uA; Total Gate Charge (Qg@Vgs): 12.2nC@4.5V; Input Capacitance (Ciss@Vds): 1.2nF@15V; Operating Temperature: -55℃~+150℃@(Tj)
R1 R3 R6 R7 = 0402WGF5101TCE: 电阻类型:厚膜电阻;阻值:5.1kΩ;精度:±1%;功率:62.5mW;最大工作电压:50V;温度系数:±100ppm/℃;; LCSC Part Name: 5.1kΩ ±1% 62.5mW 厚膜电阻; Supplier Part: C25905; Manufacturer: UNI-ROYAL(厚声); Supplier Footprint: 0402; JLCPCB Part Class: 基础库; Datasheet: https://atta.szlcsc.com/upload/public/pdf/source/20200306/C422600_1E6D84923E4A46A82E41ADD87F860B5C.pdf; Supplier: LCSC; Type: 厚膜电阻; Tolerance: ±1%; Power(Watts): 62.5mW; Overload Voltage (Max): 50V; Temperature Coefficient: ±100ppm/℃; Operating Temperature Range: -55℃~+155℃
R5 = 0402WGF2001TCE: 电阻类型:厚膜电阻;阻值:2kΩ;精度:±1%;功率:62.5mW;最大工作电压:50V;温度系数:±100ppm/℃;; LCSC Part Name: 2kΩ ±1% 62.5mW 厚膜电阻; Supplier Part: C4109; Manufacturer: UNI-ROYAL(厚声); Supplier Footprint: 0402; JLCPCB Part Class: 基础库; Datasheet: https://atta.szlcsc.com/upload/public/pdf/source/20200306/C422600_1E6D84923E4A46A82E41ADD87F860B5C.pdf; Supplier: LCSC; Type: 厚膜电阻; Tolerance: ±1%; Power(Watts): 62.5mW; Overload Voltage (Max): 50V; Temperature Coefficient: ±100ppm/℃; Operating Temperature Range: -55℃~+155℃
R9 = RC0402FR-07680KL: 电阻类型:厚膜电阻;阻值:680kΩ;精度:±1%;功率:62.5mW;最大工作电压:50V;温度系数:±100ppm/℃;; LCSC Part Name: 厚膜电阻 680kΩ ±1% 62.5mW; Supplier Part: C163456; Manufacturer: YAGEO(国巨); Supplier Footprint: 0402; JLCPCB Part Class: 扩展库; Datasheet: https://atta.szlcsc.com/upload/public/pdf/source/20181009/C309620_DA5935B6E1D48212CB7A533FE518B3C2.pdf; Supplier: LCSC; Type: 厚膜电阻; Tolerance: ±1%; Power(Watts): 62.5mW; Overload Voltage (Max): 50V; Temperature Coefficient: ±100ppm/℃; Operating Temperature Range: -55℃~+155℃
R10 = 0402WGF1503TCE: 电阻类型:厚膜电阻;阻值:150kΩ;精度:±1%;功率:62.5mW;最大工作电压:50V;温度系数:±100ppm/℃;; LCSC Part Name: 150kΩ ±1% 62.5mW 厚膜电阻; Supplier Part: C25755; Manufacturer: UNI-ROYAL(厚声); Supplier Footprint: 0402; JLCPCB Part Class: 扩展库; Datasheet: https://atta.szlcsc.com/upload/public/pdf/source/20200306/C422600_1E6D84923E4A46A82E41ADD87F860B5C.pdf; Supplier: LCSC; Type: 厚膜电阻; Tolerance: ±1%; Power(Watts): 62.5mW; Overload Voltage (Max): 50V; Temperature Coefficient: ±100ppm/℃; Operating Temperature Range: -55℃~+155℃
R49 = 0402WGF3003TCE: 电阻类型:厚膜电阻;阻值:300kΩ;精度:±1%;功率:62.5mW;最大工作电压:50V;温度系数:±100ppm/℃;; LCSC Part Name: 300kΩ ±1% 62.5mW 厚膜电阻; Supplier Part: C25774; Manufacturer: UNI-ROYAL(厚声); Supplier Footprint: 0402; JLCPCB Part Class: 扩展库; Datasheet: https://atta.szlcsc.com/upload/public/pdf/source/20200306/C422600_1E6D84923E4A46A82E41ADD87F860B5C.pdf; Supplier: LCSC; Type: 厚膜电阻; Tolerance: ±1%; Power(Watts): 62.5mW; Overload Voltage (Max): 50V; Temperature Coefficient: ±100ppm/℃; Operating Temperature Range: -55℃~+155℃
U1 = ECJ22091-90DE54 SOT23-6: Supplier Footprint: SOT-23-6; JLCPCB Part Class: Extended Part; Datasheet: https://baijiahao.baidu.com/s?id=1741403205828111126&wfr=spider&for=pc; Supplier: LCSC
U2 = TP4057_1: 工作电压:4V~6.5V;最大充电电流:500mA;电池类型:锂离子/聚合物;电池节数:1;; LCSC Part Name: TP4057  600mA线性锂离子电池充电器; Supplier Part: C21713959; Manufacturer: GOODWORK(固得沃克); Supplier Footprint: SOT-23-6; Datasheet: https://atta.szlcsc.com/upload/public/pdf/source/20250226/EA5EDD80E64A7130958AD475CD86412D.pdf; Supplier: LCSC; Voltage - Supply: 4V~6.5V; Charge Current - Max: 500mA; Type of Battery: 锂离子/聚合物; Number of Cells: 1; Operating Temperature: -40℃~+85℃
U4 = ETA3409S2F_1: Supplier: LCSC; Supplier Part: C7465553; Manufacturer: ETA(钰泰）; link: https://atta.szlcsc.com/upload/public/pdf/source/20230717/1A18EB96698AD4DC30E5926DF3CDB8A4.pdf; Supplier Footprint: SOT23-5; JLCPCB Part Class: 扩展库; Datasheet: https://atta.szlcsc.com/upload/public/pdf/source/20230717/1A18EB96698AD4DC30E5926DF3CDB8A4.pdf
USB1 = TYPE-C 16PIN 2MD(073): 连接器类型:Type-C;标准:USB 3.1;公母:母;安装方式:卧贴;触点数量:16P;端口数量:1;额定电流 - 电源:5A;工作温度范围:-25℃~+85℃;; LCSC Part Name: Type-C 母 卧贴; Supplier Part: C2765186; Manufacturer: SHOU HAN(首韩); Supplier Footprint: SMD; JLCPCB Part Class: 扩展库; Datasheet: https://atta.szlcsc.com/upload/public/pdf/source/20211123/39B17C16241EAC15C5E277BDA434118E.pdf; Supplier: LCSC; Connector Type: Type-C; Standard: USB 3.1; Gender: 母; Mounting Style: 卧贴; Number of Contacts: 16P; Number of Ports: 1; Current Rating - Power (Max): 5A; Operating Temperature Range: -25℃~+85℃; Rated Voltage (Max): 5V; Connect-Disconnect Life: 5千次; Core Colour: 黑色

## Nets
GND: C1.2 C3.1 C4.2 C5.1 C6.1 C8.1 C9.2 C10.1 C15.1 C17.1 C18.2 C19.1 C20.1 C21.1 C22.1 C23.1 C24.1 ESD1.2 ESD2.2 ESD3.2 LED2.1(K) R1.2 R3.2 R4.1 R5.1 R10.1 R12.1 R20.1 SW1.1 SW1.3(EP) SW1.4(EP) SW1.5(EP) SW2.1 SW2.3(EP) SW2.4(EP) SW2.5(EP) SW4.2 SW4.3(EP) SW4.4(EP) SW4.5(EP) SW5.2 SW5.3(EP) SW5.4(EP) SW5.5(EP) TP6.1 TP27.1 U1.2(GND) U2.2(GND) U4.2(GND) U5.1(GND) U6.1(GND) U6.40(GND) U6.41(GND) U8.3(GND) U8.4(L/R) U9.C2(GND) U23.2 U23.3 U23.4 U27.3 U27.4 USB1.1(GND) USB1.12(GND) USB1.13(SHELL) USB1.14(SHELL)
VBAT: C10.2 Q1.3(D) R49.2 U2.3(BAT) U23.1
AUX_VCC: C1.1 C3.2 D4.1(K) F1.1 Q1.2(S) U1.5(VDD)
BAT_ADC: R12.2 R49.1 U6.12(IO8)
BTN: C22.2 R54.2 SW2.2 U6.18(IO10)
ESP_3V3: C7.2 C8.2 C9.1 C17.2 C18.1 C19.2 C23.2 C24.2 L1.2 R7.2 R9.2 R17.1 R54.1 TP5.1 TP26.1 U5.3(VDD) U6.2(3V3) U8.1(VDD) U9.A1(SD_MODE#) U9.A2(VDD)
ESP_EN_RST: C15.2 R17.2 SW4.1 U6.3(EN)
ESP_IO0_BOOT: SW5.1 U6.27(IO0)
ESP_IO1: TP24.1 U6.39(IO1)
ESP_IO2: TP25.1 U6.38(IO2)
ESP_IO3: TP30.1 U6.15(IO3)
ESP_IO4: U6.4(IO4) U8.2(SCK)
ESP_IO5: U6.5(IO5) U8.5(WS)
ESP_IO6: R20.2 U6.6(IO6) U8.6(SD)
ESP_IO7: TP31.1 U6.7(IO7)
ESP_IO9: TP32.1 U6.17(IO9)
ESP_IO11: TP7.1 U6.19(IO11)
ESP_IO12: TP8.1 U6.20(IO12)
ESP_IO13: TP33.1 U6.21(IO13)
ESP_IO14: TP34.1 U6.22(IO14)
ESP_IO15: U6.8(IO15) U9.B1(DIN)
ESP_IO16: U6.9(IO16) U9.C1(BCLK)
ESP_IO17: U6.10(IO17) U9.C3(LRCLK)
ESP_IO18: R50.2 U6.11(IO18)
ESP_IO19: ESD3.1 U6.13(IO19) USB1.5(DN2) USB1.7(DN1)
ESP_IO20: ESD2.1 U6.14(IO20) USB1.6(DP1) USB1.8(DP2)
ESP_IO21: TP35.1 U6.23(IO21)
ESP_IO38: TP37.1 U6.31(IO38)
ESP_IO39: TP38.1 U6.32(IO39)
ESP_IO40: TP40.1 U6.33(IO40)
ESP_IO41: TP41.1 U6.34(IO41)
ESP_IO42: TP42.1 U6.35(IO42)
ESP_IO43_TX: TP28.1 U6.37(TXD0)
ESP_IO44_RX: TP29.1 U6.36(RXD0)
ESP_IO45: TP43.1 U6.26(IO45)
ESP_IO46: TP39.1 U6.16(IO46)
ESP_IO47: TP44.1 U6.24(IO47)
ESP_IO48: TP45.1 U6.25(IO48)
GAIN_CTRL: U9.B2(GAIN_SLOT)
OUT_N: R52.1 U9.B3(OUTN)
OUT_P: R53.1 U9.A3(OUTP)
POWER_EN: U1.1(OUTH) U4.1(EN)
USB_5V: C4.1 D4.2(A) ESD1.1 R2.1 R4.2 R6.2 U2.4(VCC) USB1.2(VBUS) USB1.11(VBUS)
$2N1885: R3.1 USB1.4(CC1)
$2N1886: R1.1 USB1.10(CC2)
$2N1891: Q1.1(G) R2.2
$2N1898: L1.1 U4.3(SW)
$2N1901: C7.1 R9.1 R10.2 U4.5(FB)
$2N1906: C5.2 C6.2 F1.2 U4.4(IN)
$2N1909: LED2.2(A) R7.1
$2N1911: R5.2 U2.6(PROG)
$2N1912: LED1.1(K) U2.1(CHRG)
$2N1918: LED1.2(A) R6.1
$2N1922: SW1.2 U1.4(KEY)
$4N5219: C21.2 R52.2 U27.1
$4N5264: C20.2 R53.2 U27.2
$6N551: R50.1 U5.2(DIN)

Not connected (* = marked no-connect by the designer): U1 3(OUTL)* 6(OPT)*; U2 5(STDBY); U5 4(DOUT)*; U6 28(IO35)* 29(IO36)* 30(IO37)*; USB1 3(SBU2)* 9(SBU1)*

## Notes on the sheets
sheet 2
- USB
- Power Auto Select
- 长按一键开关机模块
- 2K：500ma充电电流
  充电红灯亮；充满绿灯亮；
- 电池充放电模块
- DCDC降压模块
sheet 3
- IIS麦克风
- IIS功放
- 天问焊盘
- 按钮
- RGB灯
- 电量检测
- USB 刷机
- RST/BOOT 按键
- 串口焊盘
- 四个引脚，一个IIC，两个普通引脚
- 扩展引脚随便留几个
- MCU
sheet 4
- MIC
- DAC & PA
sheet 5
- 指示灯模块
- 按键
sheet 6
- ASR焊盘
- 串口焊盘
- 扩展引脚到时候会随便留几个
sheet 7
- 说明：
  1，MIC电容和丝印需要改动位置

# Board PCB_MINI_V1.0
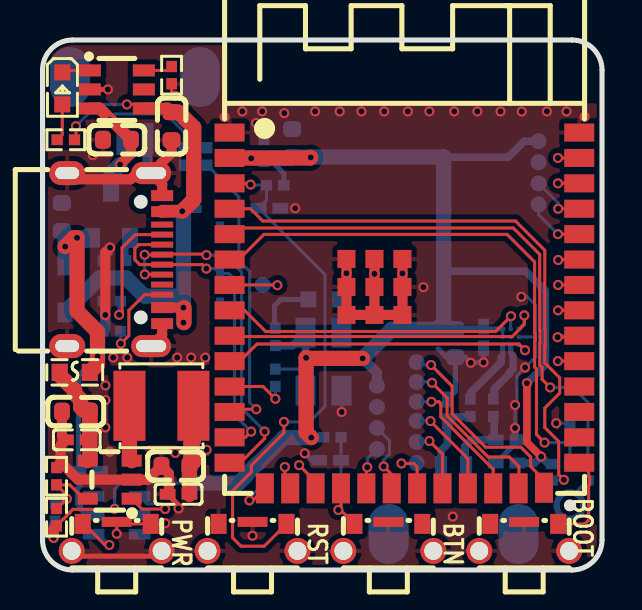
[diagram p7: board, top side]
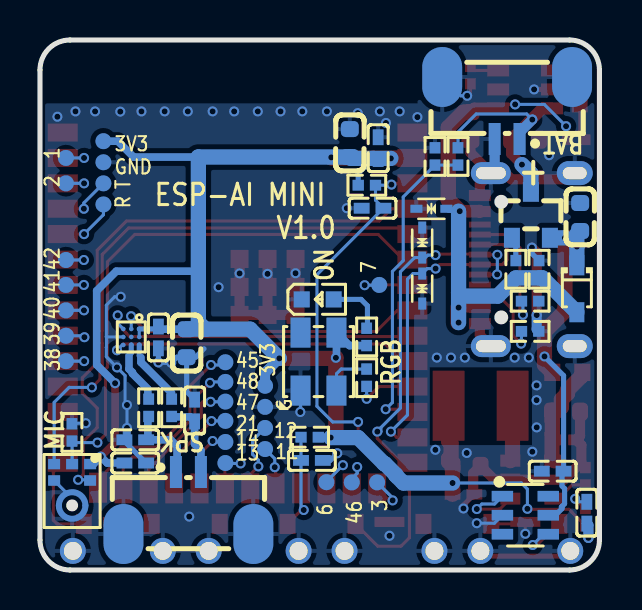
[diagram p8: board, bottom side, seen from below]

Outline 28 x 26.5 mm; copper layers: Top Layer, Bottom Layer. Coordinates in mm from the lower left corner of the outline.
Outline path: 0,25 0,1.5 arc(0.44,0.44) 1.5,0 26.5,0 arc(27.56,0.44) 28,1.5 28,25 arc(27.56,26.06) 26.5,26.5 1.5,26.5 arc(0.44,26.06) 0,25
Stack: Top Layer 0.035mm / Dielectric1 1.51mm FR4 er 4.5 / Bottom Layer 0.035mm

## Design rules (mm)
template: JLCPCB Capability(Two Layers Board)
spacing copperThickness1oz (default): track to track 0.102, other pairs 0.152 to 0.3
spacing copperThickness2oz: track to track 0.203, other pairs 0.152 to 0.3
track width copperThickness1oz (default): min 0.127, default 0.254, max 2.54
track width copperThickness2oz: min 0.203, default 0.254, max 2.54
differential pair differentialPair (default): width min 0.127, default 0.254, max 2.54; gap min 0.152, default 0.152
via viaSize (default): diameter min 0.5, default 0.61, max 10; hole min 0.3, default 0.305, max 6.3

## Placement (name value [footprint] x y rotation side)
C1  100nF  [C0402]  2.34 4.94 0 bottom
C3  10uF  [C0603]  0.97 17.65 270 bottom
C4  10uF  [C0603]  6.46 22.19 270 top
C5  10uF  [C0603]  1.67 7.92 0 top
C6  100nF  [C0402]  1.71 6.51 0 top
C7  22pF  [C0402]  0.63 2.87 270 bottom
C8  100nF  [C0402]  6.81 3.79 0 top
C9  10uF  [C0603]  6.65 5.2 180 top
C10  10uF  [C0603]  3.72 21.51 0 top
C15  1uF  [C0402]  11.36 18.09 180 bottom
C17  100nF  [C0402]  23.23 5.35 0 bottom
C18  10uF  [C0603]  20.66 11.34 270 bottom
C19  100nF  [C0402]  22.07 11.63 90 bottom
C20  220pF  [C0402]  20.26 7.97 270 bottom
C21  220pF  [C0402]  23.23 6.51 180 bottom
C22  100nF  [C0402]  14.39 5.48 0 bottom
C23  10uF  [C0603]  12.49 21.35 270 bottom
C24  100nF  [C0402]  11.07 21.09 270 bottom
D4  1N5819WS  [SOD-323_L1.8-W1.3-LS2.5-RD]  1.13 14.06 270 bottom
ESD1  LESD5D5.0CT1G  [SOD-523_L1.2-W0.8-LS1.6-BI]  8.41 18.06 0 bottom
ESD2  LESD5D5.0CT1G  [SOD-523_L1.2-W0.8-LS1.6-BI]  8.87 16.37 90 bottom
ESD3  LESD5D5.0CT1G  [SOD-523_L1.2-W0.8-LS1.6-BI]  8.87 14.07 270 bottom
F1  JK-SMD0603-100L  [F0603]  1.61 9.88 180 top
L1  2.2uH  [IND-SMD_L4.0-W4.0]  5.95 8.21 0 top
LED1  KT-0603R  [LED0603-RD]  0.99 24.08 270 top
LED2  KT-0603R  [LED0603-RD]  14.1 13.53 180 bottom
Q1  AO3401A  [SOT-23_L2.9-W1.3-P1.90-LS2.4-BR]  3.43 17.76 270 bottom
R1  5.1kΩ  [R0402]  3.47 11.93 180 bottom
R2  100kΩ  [R0402]  4.18 15.04 90 bottom
R3  5.1kΩ  [R0402]  3.47 13.44 180 bottom
R4  100kΩ  [R0402]  3.02 15.04 270 bottom
R5  2kΩ  [R0402]  6.46 24.74 90 top
R6  5.1kΩ  [R0402]  1.16 21.51 0 top
R7  5.1kΩ  [R0402]  11.65 11.65 270 bottom
R9  680kΩ  [R0402]  0.7 2.64 270 top
R10  150kΩ  [R0402]  0.7 4.69 270 top
R12  100kΩ  [R0402]  8.23 20.68 270 bottom
R17  10kΩ  [R0402]  11.64 19.24 180 bottom
R20  100kΩ  [R0402]  26.4 6.88 270 bottom
R49  300kΩ  [R0402]  7.08 20.68 90 bottom
R50  0Ω  [R0402]  11.65 9.61 270 bottom
R52  0Ω  [R0402]  22.56 8.11 270 bottom
R53  0Ω  [R0402]  21.41 8.11 270 bottom
R54  10kΩ  [R0402]  14.5 6.64 0 bottom
SW1  TS-1073A-A2B3-D4  [SW-SMD_TS-1073A-A2B3-D4]  3.71 1.68 180 top
SW2  TS-1073A-A2B3-D4  [SW-SMD_TS-1073A-A2B3-D4]  17.31 1.68 180 top
SW4  TS-1073A-A2B3-D4  [SW-SMD_TS-1073A-A2B3-D4]  10.51 1.68 180 top
SW5  TS-1073A-A2B3-D4  [SW-SMD_TS-1073A-A2B3-D4]  24.1 1.68 180 top
TP5  -  [Test-Point-0.5mm]  16.74 9.21 90 bottom
TP6  -  [Test-Point-0.5mm]  16.74 8.16 90 bottom
TP7  -  [Test-Point-0.5mm]  16.74 6.05 90 bottom
TP8  -  [Test-Point-0.5mm]  16.74 7.1 90 bottom
TP24  -  [Test-Point-0.5mm]  26.7 20.6 90 bottom
TP25  -  [Test-Point-0.5mm]  26.7 19.33 90 bottom
TP26  -  [Test-Point-0.5mm]  24.82 21.44 0 bottom
TP27  -  [Test-Point-0.5mm]  24.82 20.39 0 bottom
TP28  -  [Test-Point-0.5mm]  24.82 19.33 0 bottom
TP29  -  [Test-Point-0.5mm]  24.82 18.28 0 bottom
TP30  -  [Test-Point-0.5mm]  11.12 4.38 90 bottom
TP31  -  [Test-Point-0.5mm]  11.02 14.25 90 bottom
TP32  -  [Test-Point-0.5mm]  13.67 4.39 90 bottom
TP33  -  [Test-Point-0.5mm]  18.72 5.35 90 bottom
TP34  -  [Test-Point-0.5mm]  18.72 6.4 180 bottom
TP35  -  [Test-Point-0.5mm]  18.72 7.46 180 bottom
TP37  -  [Test-Point-0.5mm]  26.7 10.44 90 bottom
TP38  -  [Test-Point-0.5mm]  26.7 11.71 90 bottom
TP39  -  [Test-Point-0.5mm]  12.4 4.38 90 bottom
TP40  -  [Test-Point-0.5mm]  26.7 12.98 90 bottom
TP41  -  [Test-Point-0.5mm]  26.7 14.25 90 bottom
TP42  -  [Test-Point-0.5mm]  26.7 15.5 90 bottom
TP43  -  [Test-Point-0.5mm]  18.72 10.39 180 bottom
TP44  -  [Test-Point-0.5mm]  18.72 8.42 180 bottom
TP45  -  [Test-Point-0.5mm]  18.72 9.4 180 bottom
U1  ECJ22091-90DE54  [SOT-23-6_L2.9-W1.6-P0.95-LS2.8-BL_1]  3.71 2.74 270 bottom
U2  TP4057  [SOT-23-6_L2.9-W1.6-P0.95-LS2.8-BR]  3.72 24.03 180 top
U4  ETA3409S2F  [SOT-23-5_L2.9-W1.6-P0.95-LS2.8-BL_2]  3.54 4.21 180 top
U5  SK6812MINI-HS  [LED-SMD_4P-L3.5-W3.5-BR_SK6812MINI-HS]  14.06 10.42 270 bottom
U6  ESP32-S3-WROOM-1-N16R8  [WIRELM-SMD_ESP32-S3-WROOM-1]  18.11 12.98 0 top
U8  MSM261S3526Z0CM  [MIC-SMD_6P-L3.5-W2.7-P0.90-TR]  26.39 3.93 180 bottom
U9  MAX98357AEWL+T  [WLP-9_L1.4-W1.3-P0.40-R3-C3-BR]  23.43 11.65 90 bottom
U23  HCZZ0015-2  [CONN-SMD_HCZZ0015-2]  4.62 23.1 0 bottom
U27  HCZZ0015-2  [CONN-SMD_HCZZ0015-2]  20.57 3.35 180 bottom
USB1  TYPE-C 16PIN 2MD(073)  [USB-C-SMD_TYPE-C-6PIN-2MD-073]  3.61 15.52 270 top

## Footprints (pads in the part's own frame, mm; a bottom-side part is the same pattern mirrored in y, then rotated)
C0402
  rect 0.79x0.54 smd: 1(-0.545,0) 2(0.545,0)
C0603
  rrect 0.8x0.9 smd: 1(-0.7,0) 2(0.7,0)
CONN-SMD_HCZZ0015-2
  rect 0.6x1.6 smd: 1(-0.625,1.55) 2(0.625,1.55)
  oval 2x3 smd: 3(-3.25,-1.55) 4(3.25,-1.55)
F0603
  rect 0.806x0.864 smd: 1(-0.753,0) 2(0.753,0)
IND-SMD_L4.0-W4.0
  rect 1.6x3.5 smd: 1(-1.6,0) 2(1.6,0)
LED0603-RD
  rect 0.8x0.8 smd: 1(-0.799,0) 2(0.799,0)
LED-SMD_4P-L3.5-W3.5-BR_SK6812MINI-HS
  rect 1.5x1 smd: 1(1.45,-0.9) 2(1.45,0.9) 3(-1.45,0.9) 4(-1.45,-0.9)
MIC-SMD_6P-L3.5-W2.7-P0.90-TR
  rect 0.6x0.52 smd: 1(0.9,1.367) 2(0.9,0.545) 4(-0.9,0.545) 5(-0.9,1.367) 6(0,1.367)
  custom 1.626x0.966 smd: 3(0,-1.367)
  custom 1.626x0.963 smd: 3(0,-0.042)
R0402
  rect 0.566x0.54 smd: 1(-0.433,0) 2(0.433,0)
SOD-323_L1.8-W1.3-LS2.5-RD
  rect 1x0.75 smd: 1(-1.173,0) 2(1.173,0)
SOD-523_L1.2-W0.8-LS1.6-BI
  rect 0.6x0.4 smd: 1(-0.75,0) 2(0.75,0)
SOT-23-5_L2.9-W1.6-P0.95-LS2.8-BL_2
  rect 1x0.6 smd: 1(-0.924,0.647) 2(-0.924,-0.302) 3(-0.924,-1.252) 4(1.276,-1.252) 5(1.276,0.647)
SOT-23-6_L2.9-W1.6-P0.95-LS2.8-BL_1
  rect 0.531x1.072 smd: 1(-0.95,-1.148) 2(0,-1.148) 3(0.95,-1.148) 4(0.95,1.148) 5(0,1.148) 6(-0.95,1.148)
SOT-23-6_L2.9-W1.6-P0.95-LS2.8-BR
  rect 1.1x0.6 smd: 1(1.35,-0.95) 2(1.35,0) 3(1.35,0.95) 4(-1.35,0.95) 5(-1.35,0) 6(-1.35,-0.95)
SOT-23_L2.9-W1.3-P1.90-LS2.4-BR
  rect 1x0.8 smd: 1(1.15,-0.95) 2(1.15,0.95) 3(-1.15,0)
SW-SMD_TS-1073A-A2B3-D4
  rect 0.8x1 smd: 1(-1.7,-0.625) 2(1.7,-0.625)
  round 1.3 hole 0.9: 3(-2.25,0.725) 4(2.25,0.725)
  rect 1.5x0.5 smd: 5(0,-0.725)
Test-Point-0.5mm
  round 0.8 smd: 1(0,0)
USB-C-SMD_TYPE-C-6PIN-2MD-073
  rect 0.55x1.1 smd: 1(-3.2,2.375) 2(-2.4,2.375) 11(2.4,2.375) 12(3.2,2.375)
  rect 0.3x1.1 smd: 3(-1.75,2.375) 4(-1.25,2.375) 5(-0.75,2.375) 6(-0.25,2.375) 7(0.25,2.375) 8(0.75,2.375) 9(1.25,2.375) 10(1.75,2.375)
  oval 1.1x2 hole 0.6x1.5: 13(-4.325,1.825) 14(4.325,1.825)
  oval 1.2x1.8 hole 0.6x1.2: 13(-4.325,-2.375) 14(4.325,-2.375)
WIRELM-SMD_ESP32-S3-WROOM-1
  rect 1.5x0.9 smd: 1(-8.75,8.895) 2(-8.75,7.625) 3(-8.75,6.355) 4(-8.75,5.085) 5(-8.75,3.815) 6(-8.75,2.545) 7(-8.75,1.275) 8(-8.75,0.005) 9(-8.75,-1.265) 10(-8.75,-2.535) 11(-8.75,-3.805) 12(-8.75,-5.075) 13(-8.75,-6.345) 14(-8.75,-7.615) 27(8.75,-7.615) 28(8.75,-6.345) 29(8.75,-5.075) 30(8.75,-3.805) 31(8.75,-2.535) 32(8.75,-1.265) 33(8.75,0.005) 34(8.75,1.275) 35(8.75,2.545) 36(8.75,3.815) 37(8.75,5.085) 38(8.75,6.355) 39(8.75,7.625) 40(8.75,8.895)
  rect 0.9x1.5 smd: 15(-6.985,-8.895) 16(-5.715,-8.895) 17(-4.445,-8.895) 18(-3.175,-8.895) 19(-1.905,-8.895) 20(-0.635,-8.895) 21(0.635,-8.895) 22(1.905,-8.895) 23(3.175,-8.895) 24(4.445,-8.895) 25(5.715,-8.895) 26(6.985,-8.865)
  rect 0.9x0.9 smd: 41(-2.9,2.575) 41(-2.9,1.175) 41(-2.9,-0.225) 41(-1.5,2.575) 41(-1.5,1.175) 41(-1.5,-0.225) 41(-0.1,2.575) 41(-0.1,1.175) 41(-0.1,-0.225)
WLP-9_L1.4-W1.3-P0.40-R3-C3-BR
  round 0.23 smd: A1(0.4,-0.4) A2(0,-0.4) A3(-0.4,-0.4) B1(0.4,0) B2(0,0) B3(-0.4,0) C1(0.4,0.4) C2(0,0.4) C3(-0.4,0.4)

## Nets
As in the schematic.

Pads without a net: U1 3 6; U2 5; U5 4; U6 28 29 30; USB1 3 9

## Via types
v1: diameter 0.503, hole 0.305, Top Layer to Bottom Layer, 113 vias
v2: diameter 0.61, hole 0.305, Top Layer to Bottom Layer, 3 vias

## Routing (per net, layer and track width the routed paths; a pad name or vN(x,y) marks a point on that pad's centre or on a via; arc(x,y) is an arc through that point)
GND: length 70.9
  Top Layer w0.152: v1(6.14,2.34) 6.11,2.3 SW1.1 3.81,2.3 SW1.5 v1(3.71,1.81) ; R5.1 6.46,23.87 v1(6.62,23.71)
  Top Layer w0.254: U2.2 3.27,24.03 ; C8.1 6.81,3.24 v1(6.81,3.08) ; SW1.4 1.72,0.69 5.7,0.69 SW1.3
  Top Layer w0.508: USB1.13 1.55,19.53 4.41,19.53 4.72,19.84 USB1.13 ; USB1.1 5.99,19.3 USB1.13 ; 6.32,3.77 6.32,4.83 C9.2 5.26,4.52 U4.2 1.77,4.52 0.9,5.39 ; C4.2 6.46,20.87 USB1.13 ; 0.9,5.39 0.9,6.24 C6.1 0.97,6.71 C5.1 ; 0.9,5.39 0.9,5.18 ; USB1.14 5.99,11.75 USB1.12 ; v1(3.38,16.12) 3.14,15.88 v1(3.14,12.75) ; U6.41 v1(16.61,14.81) U6.41 U6.41 ; U6.41 U6.41 U6.41 v1(15.21,14.84) U6.41 ; U6.41 U6.41 U6.41 v1(18.01,14.83) U6.41
  Bottom Layer w0.152: v1(6.14,2.34) 5.26,2.34 U1.2 ; 24.67,11.65 24.68,11.66 24.68,13.24 24.26,13.66 v1(23.96,13.66) ; 24.67,11.65 24.67,11.14 24.68,11.14 24.68,10.66 v1(24.15,10.13) 23.74,9.72 23.74,8.34 v1(23.65,8.25) v1(23.65,7.1) ; 24.67,11.65 U9.C2 ; U8.3 26.7,3.89 U8.4 ; v1(6.62,23.71) 6.93,23.71 U23.4 ; v1(14.97,7.9) 14.96,7.91 U5.1 ; R20.1 26.37,7.34 v1(25.71,7.34)
  Bottom Layer w0.254: C19.1 v1(22.07,10.38) 21.45,10.38 v1(21.43,10.36) 21.15,10.64 C18.2 ; v1(3.38,16.12) 3.38,15.83 3.02,15.47 ; C21.1 23.77,6.44 22.68,5.35 ; C20.1 20.66,8.92 C18.2 ; C18.2 20.21,10.64 19.79,11.06 ; v1(13.12,5.84) 13.48,5.48 C22.1
  Bottom Layer w0.381: v1(23.65,7.1) 23.65,6.64 C21.1
  Bottom Layer w0.508: v1(3.14,12.75) 3.14,12.04 R1.2 ; U23.2 5.25,20.03 USB1.13
  vias: v1(2.52,20.74) v1(3.15,9.23) v1(3.15,8.49) v1(3.14,7.13) v1(3.27,24.03) v1(3.36,5.91) v1(3.53,10.62) v1(4.24,10.62) v1(6.64,5.85) v1(6.74,10.62) v1(7.43,10.62) v1(8.14,10.62) v1(8.21,6.01) v1(9.11,22.64) v1(10,22.93) v1(10.51,1.71) v1(10.68,22.35) v1(10.99,22.93) v1(12.1,22.84) v1(12.64,18.09) v1(13.64,22.93) v1(14.87,22.93) v1(15.96,22.93) v1(17.1,22.93) v1(18.28,22.93) v1(19.06,14.14) v1(19.36,22.93) v1(20.53,2.67) v1(20.6,22.93) v1(21.76,22.93) v1(22.92,22.93) v1(23.98,22.92) v1(25.24,22.93) v1(26.22,22.93) v1(27.13,22.66)
VBAT: length 11.9
  Top Layer w0.508: v1(3.88,20.27) 4.42,20.81 C10.2
  Top Layer w0.584: 3.54,22.4 4.42,21.52 C10.2 ; 3.53,22.4 2.85,23.08 U2.3
  Bottom Layer w0.152: v1(3.36,22.52) 3.64,22.8 6.17,22.8 7.08,21.89 7.08,21.11
  Bottom Layer w0.508: U23.1 4,21.89 v1(3.36,22.52)
  Bottom Layer w0.762: v1(3.88,20.27) 3.43,19.82 Q1.3
AUX_VCC: length 19.7
  Top Layer w0.762: v1(1.13,16.17) 1.57,16.61 v1(1.73,16.61) 1.73,12.94 2.75,11.92 v1(2.75,10.68) 2.75,10.27 F1.1
  Bottom Layer w0.254: 1.87,3.18 1.91,3.14 ; 1.87,3.18 1.87,3.07 2.2,2.74 U1.5 ; 1.87,3.18 1.75,3.31 1.75,4.07 1.87,4.2 1.87,4.86 C1.1 1.8,9.72 v1(2.75,10.68)
  Bottom Layer w0.762: Q1.2 v1(1.73,16.61) ; D4.1 v1(1.13,16.17) 1.13,16.78 C3.2
BAT_ADC: length 15.8
  Top Layer w0.152: U6.12 9.5,8.04 v1(10.7,8.04)
  Bottom Layer w0.152: R49.1 R12.2 9.82,18.65 9.82,15.47 10.36,14.93 10.36,8.38 v1(10.7,8.04)
BTN: length 5.9
  Top Layer w0.152: U6.18 14.94,3.13 v1(14.8,3) 14.91,3 SW2.2
  Bottom Layer w0.152: R54.2 C22.2 14.94,3.13 v1(14.8,3)
ESP_3V3: length 87
  Top Layer w0.152: R9.2 1.05,2.56 1.06,2.56 1.2,2.7 1.2,2.71 1.38,2.89 1.38,2.9 1.52,3.03 3.58,3.03 v1(3.61,3.06)
  Top Layer w0.381: v1(24.95,5.67) 24.24,6.38 v1(24.24,9.34)
  Top Layer w0.508: R9.2 0.55,2.06 v1(0.55,1.61)
  Top Layer w0.762: 7.35,3.79 v1(7.35,4.35) 7.35,5.2 7.55,5.4 7.55,5.56 7.43,5.69 7.43,6.33 7.55,6.46 L1.2 ; v1(13.45,6.62) 13.19,6.88 v1(13.19,10.61) 13.22,10.58 v1(16.02,10.58) ; v1(13.42,20.63) 13.39,20.6 U6.2
  Bottom Layer w0.152: 23.03,12.05 U9.A2 ; R54.1 14.05,6.62 v1(13.45,6.62) ; v1(3.61,3.06) 3.61,4.05 3.91,4.35 v1(7.35,4.35)
  Bottom Layer w0.254: 11.32,20.58 12.07,19.83 R17.1 ; 23.03,12.05 22.19,12.05 ; v1(13.42,20.63) 13.37,20.58
  Bottom Layer w0.381: R7.2 12.51,11.22 U5.3 13.16,10.64 v1(13.19,10.61) ; 20.07,14.83 20.18,14.94 24.18,14.94 25.16,13.96 25.16,10.26 v1(24.24,9.34) ; 20.08,20.65 23.31,20.65 24.11,21.44 TP26.1 ; U8.1 25.32,5.3 v1(24.95,5.67) 24.63,5.35 C17.2 ; C18.1 21.94,12.04
  Bottom Layer w0.508: v1(16.02,10.58) 16.74,9.86 TP5.1 ; C7.2 0.55,2.24 v1(0.55,1.61)
  Bottom Layer w0.762: v1(13.45,6.62) 12.08,6.62 10.77,5.31 10.74,5.31 10.19,4.77 10.19,4.73 9.81,4.35 v1(7.35,4.35) ; v1(16.02,10.58) 17.48,12.04 19.73,12.04 ; 19.73,12.04 20.07,12.38 20.07,20.64 20.08,20.65 C23.2 12.42,20.58 v1(10.44,20.58) ; 19.73,12.04 C18.1
ESP_EN_RST: length 27.1
  Top Layer w0.152: SW4.1 11.09,1.19 9.93,1.19 9.51,1.61 9.51,3.96 10.45,4.9 10.45,5.23 12.08,6.86 v1(12.08,7.4) ; v1(10.41,19.27) 10.35,19.33 U6.3
  Bottom Layer w0.152: v1(12.08,7.4) 13.35,7.4 14.14,8.19 14.14,14.76 C15.2 11.21,18.49 R17.2 10.44,19.24 v1(10.41,19.27)
ESP_IO0_BOOT: length 4.7
  Top Layer w0.152: U6.27 27.33,4.89 27.33,4.71 27.38,4.66 27.38,4.26 27.33,4.21 27.33,2.49 27.15,2.3 SW5.1
ESP_IO1: length 2
  Top Layer w0.152: U6.39 v1(25.79,20.6)
  Bottom Layer w0.152: TP24.1 v1(25.79,20.6)
ESP_IO2: length 2
  Top Layer w0.152: U6.38 v1(25.79,19.33)
  Bottom Layer w0.152: TP25.1 v1(25.79,19.33)
ESP_IO3: length 2.2
  Top Layer w0.152: v1(10.35,3.48) 10.52,3.48 U6.15
  Bottom Layer w0.152: TP30.1 10.35,3.61 v1(10.35,3.48)
ESP_IO4: length 29.8
  Top Layer w0.152: v1(26.09,4.51) 25.83,4.77 25.83,6.43 25.13,7.12 25.13,8.1 25.88,8.84 25.88,9.61 25.13,10.36 25.13,11.23 25.15,11.24 25.15,12.06 25.13,12.08 25.13,15.99 23.67,17.45 11.02,17.45 10.41,18.06 U6.4
  Bottom Layer w0.152: v1(26.09,4.51) 25.52,4.51 U8.2
ESP_IO5: length 28.4
  Top Layer w0.152: U6.5 9.67,17.1 23.56,17.1 24.88,15.78 24.88,11.97 24.9,11.96 24.9,11.35 24.88,11.33 24.88,10.25 25,10.13 25,9.53 v1(25.4,9.13)
  Bottom Layer w0.152: U8.5 27.29,8.38 26.54,9.13 v1(25.4,9.13)
ESP_IO6: length 28
  Top Layer w0.152: v1(25.12,6.37) 24.72,6.77 24.72,10.05 24.63,10.14 24.63,11.44 24.64,11.45 24.64,11.85 24.63,11.87 24.63,15.4 23.25,16.78 11.08,16.78 9.82,15.52 U6.6
  Bottom Layer w0.152: v1(25.12,6.37) 26.32,6.37 R20.2 ; U8.6 26.39,6.42
ESP_IO7: length 3.1
  Top Layer w0.152: U6.7 11.74,14.25 v1(11.75,14.24)
  Bottom Layer w0.152: v1(11.75,14.24) 11.03,14.24 TP31.1
ESP_IO9: length 2.7
  Top Layer w0.152: U6.17 13.67,4.42 v1(12.84,5.24)
  Bottom Layer w0.152: v1(12.84,5.24) 13.67,4.42 TP32.1
ESP_IO11: length 2.2
  Top Layer w0.152: v1(16.25,5.14) 16.21,5.09 U6.19
  Bottom Layer w0.152: v1(16.25,5.14) 16.25,5.56 TP7.1
ESP_IO12: length 3.6
  Top Layer w0.152: v1(17.07,5.18) 17.48,4.77 U6.20
  Bottom Layer w0.152: v1(17.07,5.18) 17.07,5.49 17.36,5.79 17.36,6.47 TP8.1
ESP_IO13: length 2.7
  Top Layer w0.152: U6.21 18.75,5.16 18.57,5.33 v1(17.96,5.33)
  Bottom Layer w0.152: v1(17.96,5.33) 18.7,5.33 TP33.1
ESP_IO14: length 3.3
  Top Layer w0.152: U6.22 20.02,5.8 v1(19.36,6.45)
  Bottom Layer w0.152: v1(19.36,6.45) 19.31,6.4 TP34.1
ESP_IO15: length 15.5
  Top Layer w0.152: v1(23.44,12.69) 22.68,11.93 11.16,11.93 10.11,12.98 U6.8
  Bottom Layer w0.152: v1(23.44,12.69) 23.43,12.68 23.43,12.05
ESP_IO16: length 16.3
  Top Layer w0.152: v1(24.11,12.73) 24.11,12.28 23.68,11.85 23.68,11.84 23.51,11.67 9.4,11.67 U6.9
  Bottom Layer w0.152: v1(24.11,12.73) 24.11,12.33 23.83,12.05
ESP_IO17: length 15.7
  Top Layer w0.152: U6.10 9.87,10.44 10.73,11.3 23.83,11.3 v1(24.15,10.99)
  Bottom Layer w0.152: v1(24.15,10.99) 23.88,11.25 U9.C3
ESP_IO18: length 3.2
  Top Layer w0.152: U6.11 11.04,9.17 v1(11.65,8.56)
  Bottom Layer w0.152: 11.65,8.56 R50.2
ESP_IO19: length 16.6
  Top Layer w0.152: USB1.5 4.81,16.27 4.62,16.08 4.62,15.52 4.87,15.27 USB1.7 8,15.27 v1(8.2,15.07) ; U6.13 10.15,6.63 v1(10.44,6.92)
  Bottom Layer w0.152: v1(8.2,15.07) 8.62,15.07 ESD3.1 9.33,14.82 9.61,14.54 9.61,7.75 v1(10.44,6.92)
ESP_IO20: length 18.2
  Top Layer w0.152: v1(8.2,15.74) 8.15,15.8 6.01,15.8 USB1.6 5.98,15.76 5.17,15.76 ; v1(5.12,14.78) 5.98,14.78 USB1.8 ; U6.14 9.9,5.36 11.12,6.58 v1(11.12,6.92)
  Bottom Layer w0.152: 8.87,15.56 8.77,15.56 8.59,15.74 v1(8.2,15.74) ; v1(5.12,14.78) 5.11,14.79 v1(5.11,15.76) ; ESD2.1 9.25,15.62 9.96,14.91 9.96,8.1 10.94,7.12 10.94,6.92 v1(11.12,6.92)
ESP_IO21: length 4.8
  Top Layer w0.152: v1(19.42,7.45) 19.42,7.43 21.29,5.56 U6.23
  Bottom Layer w0.152: TP35.1 19.41,7.46 v1(19.42,7.45)
ESP_IO38: length 2
  Top Layer w0.152: U6.31 v1(25.79,10.44)
  Bottom Layer w0.152: TP37.1 v1(25.79,10.44)
ESP_IO39: length 2.1
  Top Layer w0.152: v1(25.78,11.64) 26.79,11.64 U6.32
  Bottom Layer w0.152: TP38.1 25.85,11.71 v1(25.78,11.64)
ESP_IO40: length 2
  Top Layer w0.152: U6.33 v1(25.8,12.98)
  Bottom Layer w0.152: TP40.1 v1(25.8,12.98)
ESP_IO41: length 2
  Top Layer w0.152: U6.34 v1(25.8,14.25)
  Bottom Layer w0.152: TP41.1 v1(25.8,14.25)
ESP_IO42: length 2
  Top Layer w0.152: v1(25.8,15.5) 25.83,15.52 U6.35
  Bottom Layer w0.152: TP42.1 v1(25.8,15.5)
ESP_IO43_TX: length 2.7
  Top Layer w0.152: v1(25.8,18.06) U6.37
  Bottom Layer w0.152: TP28.1 25.8,18.35 v1(25.8,18.06)
ESP_IO44_RX: length 3
  Top Layer w0.152: U6.36 v1(25.79,16.79)
  Bottom Layer w0.152: v1(25.79,16.79) 24.82,17.76 TP29.1
ESP_IO45: length 10.3
  Top Layer w0.152: U6.26 25.09,4.5 24.43,5.17 24.43,5.65 23.94,6.14 22.17,6.14 20.5,7.81 20.5,9.19 v1(19.44,10.25)
  Bottom Layer w0.152: v1(19.44,10.25) 18.86,10.25 TP43.1
ESP_IO46: length 1.9
  Top Layer w0.152: v1(12.12,5.15) 12.12,4.35 U6.16
  Bottom Layer w0.152: 12.42,4.54 12.12,4.83 v1(12.12,5.15)
ESP_IO47: length 6.6
  Top Layer w0.152: v1(19.46,8.41) 19.85,8.41 19.93,8.33 19.93,7.66 22.56,5.04 U6.24
  Bottom Layer w0.152: TP44.1 18.73,8.41 v1(19.46,8.41)
ESP_IO48: length 8.5
  Top Layer w0.152: v1(19.49,9.36) 20.24,8.61 20.24,7.71 22.3,5.65 23.36,5.65 23.84,5.17 23.84,4.1 U6.25
  Bottom Layer w0.152: v1(19.49,9.36) 19.45,9.4 TP45.1
OUT_N: length 3.1
  Bottom Layer w0.254: U9.B3 23.43,10.85 23.56,10.72
  Bottom Layer w0.381: 22.6,8.54 22.6,9.05 23.37,9.82 23.37,9.88 23.54,10.05 23.54,10.7
OUT_P: length 3.4
  Bottom Layer w0.254: 22.95,10.63 23.03,10.71 U9.A3
  Bottom Layer w0.381: 22.95,10.63 22.95,10.39 21.42,8.86 21.42,8.52
POWER_EN: length 3.4
  Top Layer w0.152: U4.1 4.98,3.05 v1(6.14,3.05)
  Bottom Layer w0.152: U1.1 5.25,3.3 5.89,3.3 v1(6.14,3.05)
USB_5V: length 28.1
  Top Layer w0.152: R6.2 1.67,21.58 v1(1.67,22.19) ; v1(4.22,23.28) 4.87,23.28 U2.4
  Top Layer w0.508: USB1.11 7.05,13.12
  Top Layer w0.584: U2.4 6.27,23.08 C4.1
  Top Layer w0.635: v2(6.99,17.94) 6.01,17.94 USB1.2
  Top Layer w0.762: 7.08,13.12 7.08,12.37 ; v2(6.99,17.94) 7.57,18.52 7.57,22.12 6.8,22.89 C4.1
  Bottom Layer w0.152: v2(6.99,17.94) 7.54,17.94 ESD1.1 ; v1(4.22,23.28) 2.76,23.28 v1(1.67,22.19)
  Bottom Layer w0.762: 7.05,13.86 v2(7.05,13.12) v2(7.05,12.37) ; 7.05,13.86 7.05,17.94 ; 7.05,13.86 6.89,13.7 5.09,13.7 R2.1 R4.2 2.85,14.6 D4.2
$2N1885: length 6.4
  Top Layer w0.152: v1(3.83,12.76) 3.98,12.91 3.98,16.11 4.64,16.77 USB1.4
  Bottom Layer w0.152: v1(3.83,12.76) 3.83,13.37 R3.1
$2N1886: length 4.4
  Top Layer w0.152: v1(3.92,11.32) 4.32,11.72 4.32,12.98 5.11,13.77 USB1.10
  Bottom Layer w0.152: v1(3.92,11.32) 3.9,11.34 R1.1
$2N1891: length 1.2
  Bottom Layer w0.254: 4.18,15.47 4.18,16.41 Q1.1
$2N1898: length 2.8
  Top Layer w0.762: L1.1 4.35,5.58 U4.3
$2N1901: length 4.1
  Top Layer w0.152: R9.1 0.73,3.07 v1(1.21,3.56) 1.21,3.74 R10.2 1.36,4.26 2.05,3.57 U4.5
  Bottom Layer w0.152: v1(1.21,3.56) 1.06,3.41 C7.1
$2N1906: length 5.3
  Top Layer w0.762: U4.4 2.37,5.58 2.37,6.79 2.36,6.8 2.36,7.45 2.37,7.47 C5.2 2.37,7.99 2.06,7.99 1.9,8.15 1.9,8.52 1.6,8.82 1.6,8.99 0.86,9.73 F1.2
$2N1909: length 3
  Bottom Layer w0.254: R7.1 11.61,12.13 11.61,13.21 11.93,13.53 13.3,13.53
$2N1911: length 1.5
  Top Layer w0.152: R5.2 6.26,24.98 U2.6
$2N1912: length 1.4
  Top Layer w0.152: 0.99,24.88 1.09,24.98 U2.1
$2N1918: length 1.9
  Top Layer w0.152: LED1.2 0.99,21.77 R6.1
$2N1922: length 2.8
  Top Layer w0.152: v1(3.34,1.25) 3.33,1.26 3.12,1.26 2.07,2.3 SW1.2
  Bottom Layer w0.152: U1.4 2.8,1.79 v1(3.34,1.25)
$4N5219: length 4.2
  Bottom Layer w0.381: U27.1 21.14,4.96 21.14,6.19 21.46,6.51 22.66,6.51 22.6,6.56 22.6,7.68
$4N5264: length 3.9
  Bottom Layer w0.381: U27.2 19.95,5.98 20.26,6.3 C20.2 20.49,7.66 21.42,7.66
$6N551: length 2.4
  Bottom Layer w0.152: U5.2 13.16,9.81 12.92,10.05 11.65,10.05

## Copper pours and planes (outline as drawn; the poured copper is in the pictures)
GND on Top Layer: -1.8,30.66 31.94,30.66 31.94,-2.6 -1.8,-2.6
GND on Bottom Layer: -3.6,30.61 31.98,30.61 31.98,-1.82 -3.6,-1.82

## Text on the board
Bottom Silkscreen Layer: 3V3 | GND | T | R | 38 | 42 | 41 | 40 | 39 | 45 | 48 | 47 | 21 | 14 | 3 | 7 | 46 | G | 1 | 2 | 11 | 12 | 13 | 9 | BAT | SPK | MIC | RGB | ON | V1.0 | ESP-AI MINI | +
Top Silkscreen Layer: PWR | RST | BTN | BOOT
